# EAGLE schematic RefOsc10MHz_3V0 (EAGLE 7.2.0)
DF4IAH - 10 MHz Reference Oscillator

## Sheet 1 of 15: Overview
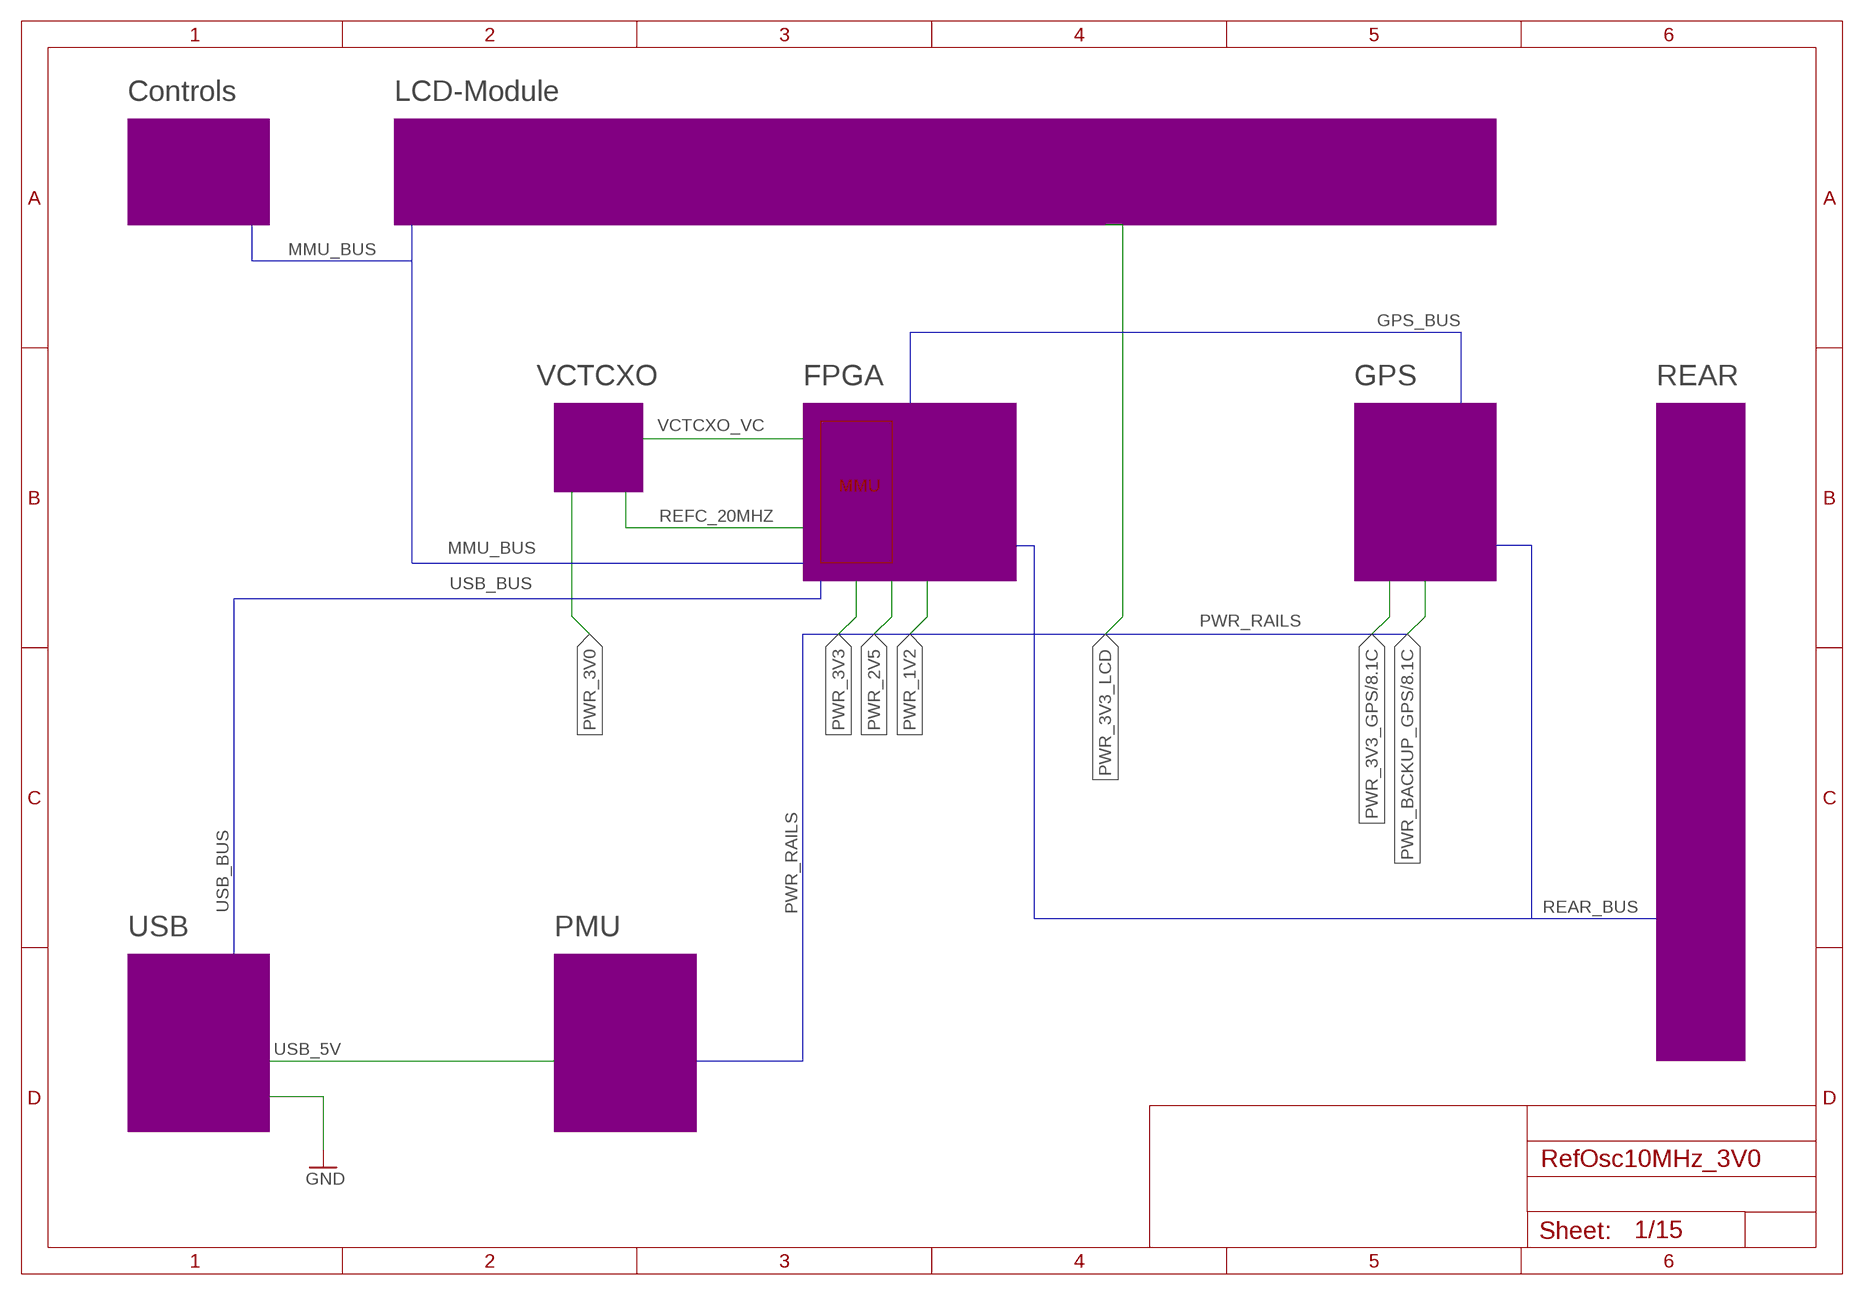
[diagram p0: schematic, sheet 1]

### Buses
USB_BUS
PWR_RAILS
GPS_BUS
REAR_BUS
MMU_BUS

### Notes on the sheet
- Controls | LCD-Module
- VCTCXO | FPGA | GPS | REAR
- MMU
- USB | PMU

## Sheet 2 of 15: FPGA_B1
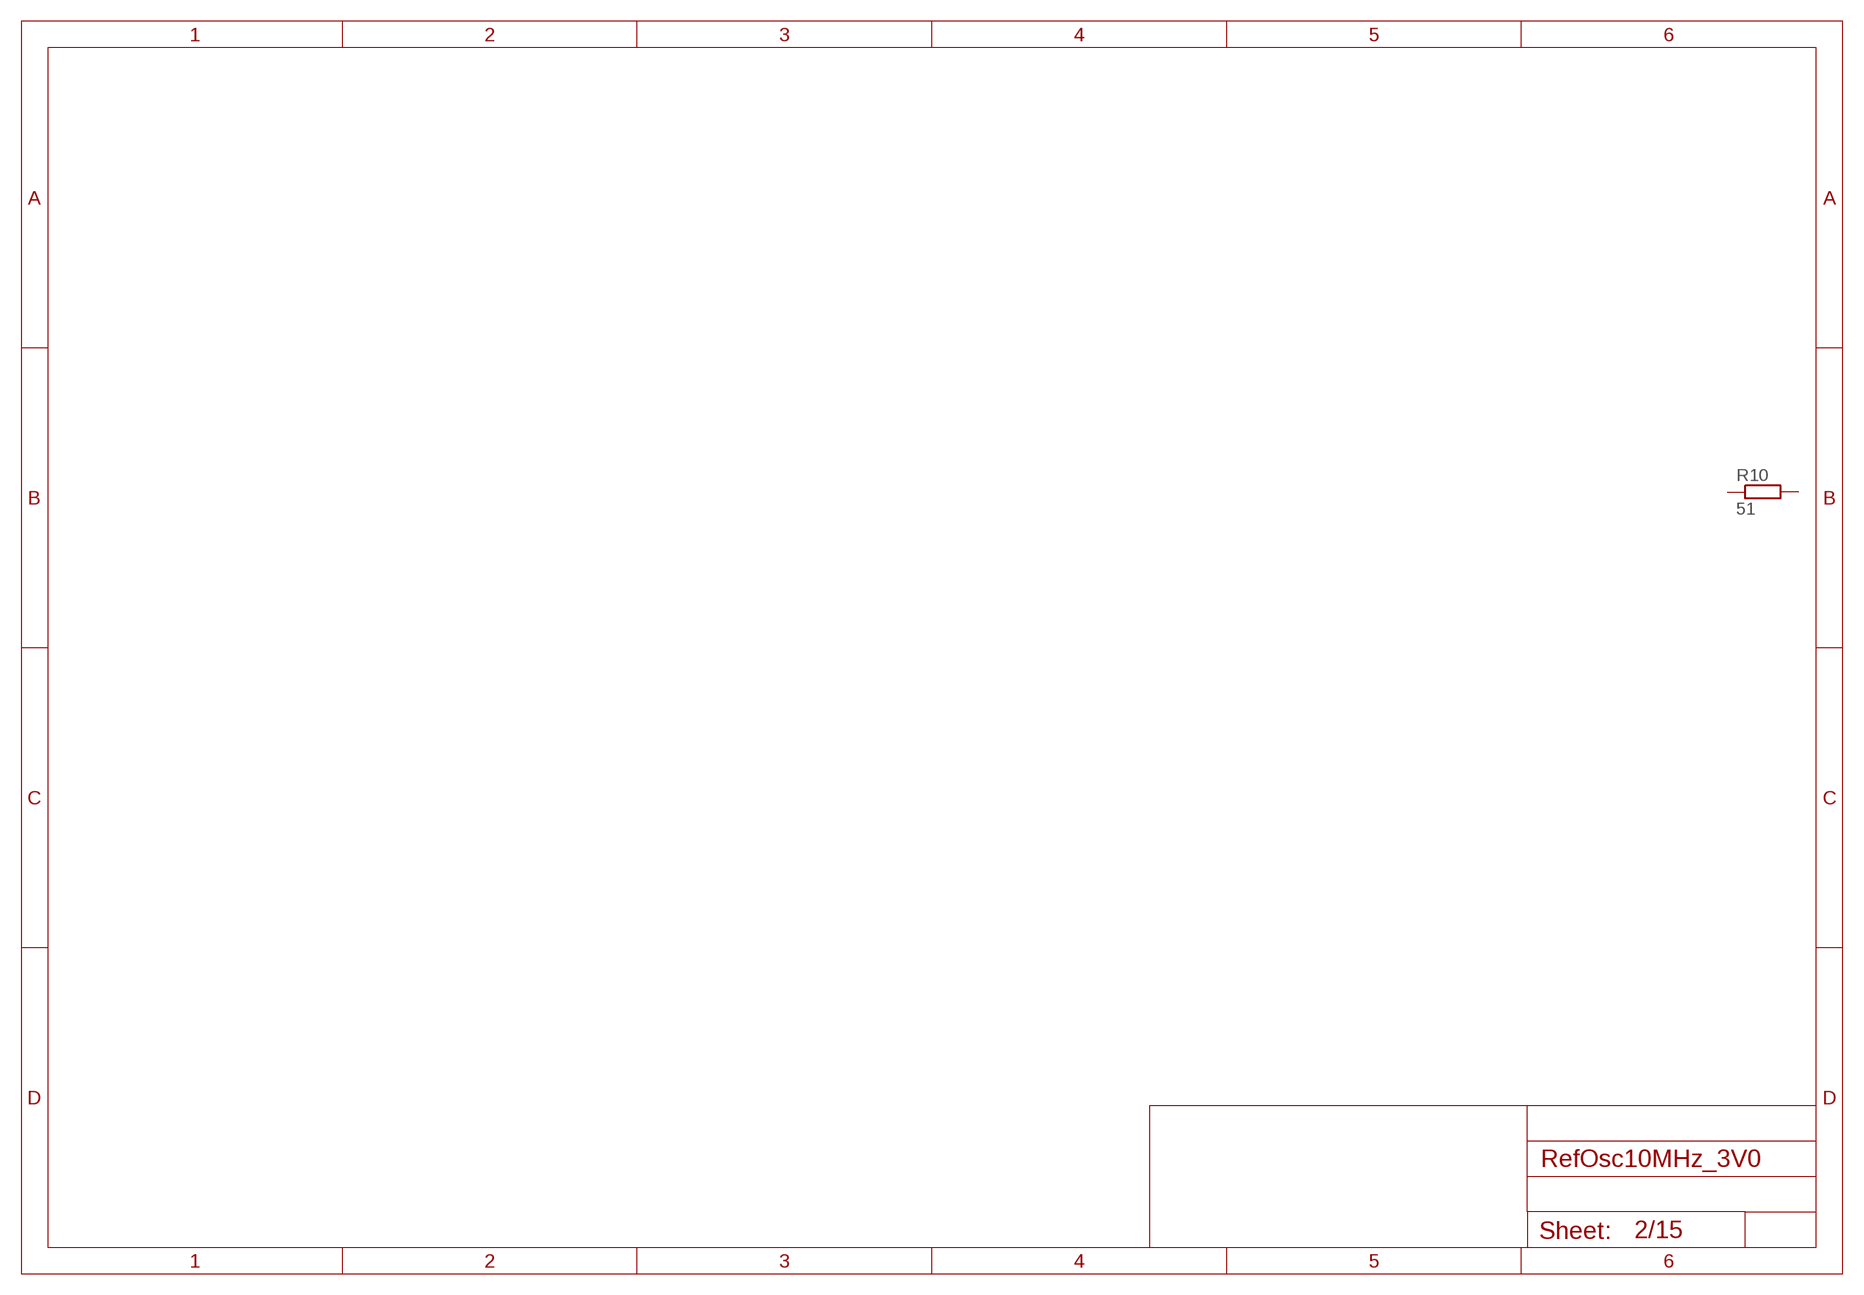
[diagram p1: schematic, sheet 2]

### Parts
R10  51  R-EU_R0805  [R0805]
Unconnected: R10.1 R10.2

## Sheet 3 of 15: FPGA_B2
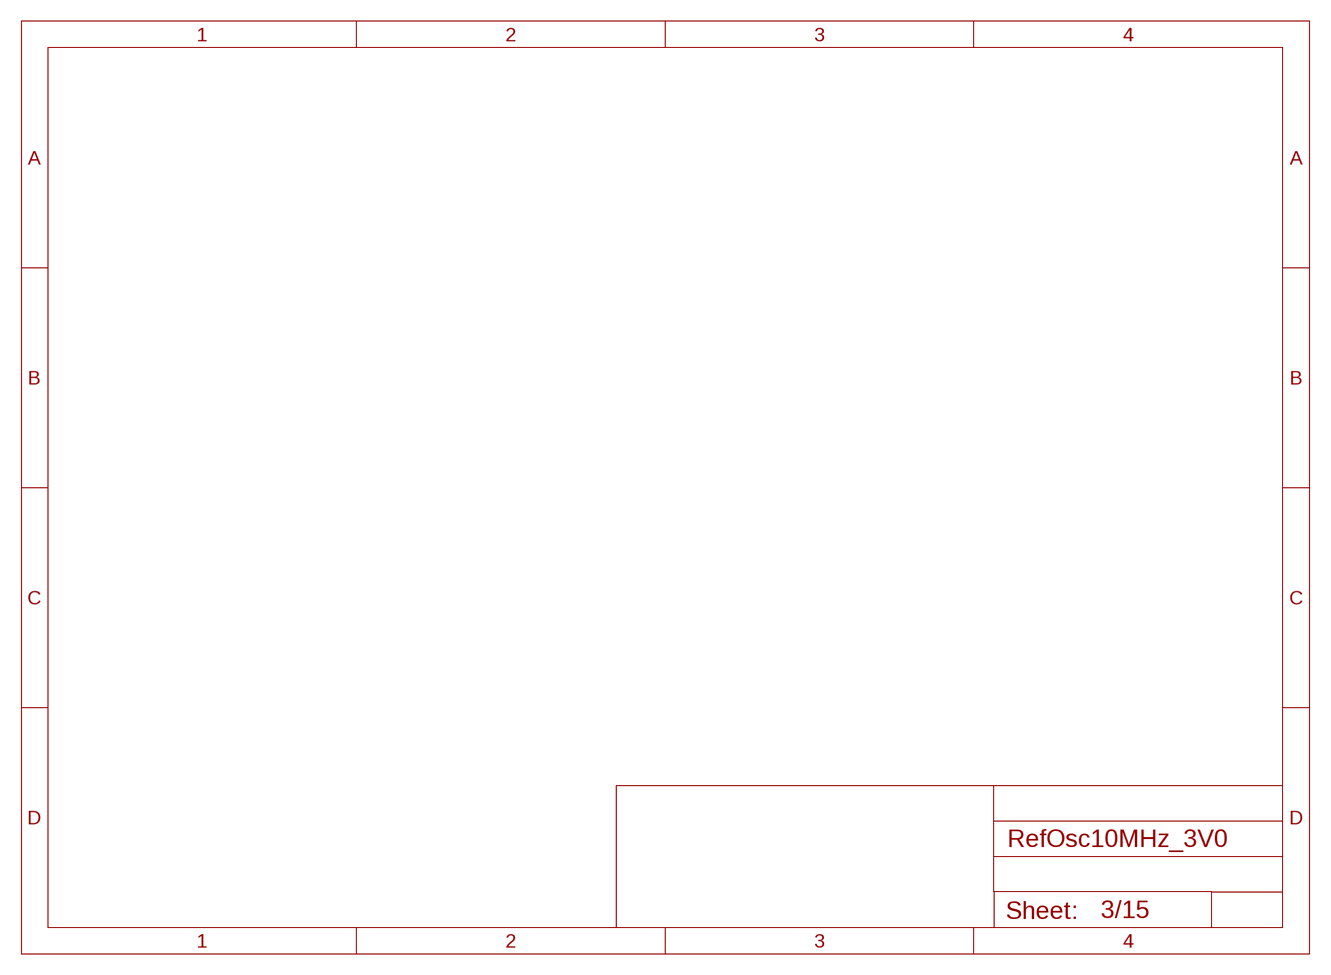
[diagram p2: schematic, sheet 3]

## Sheet 4 of 15: FPGA_B3
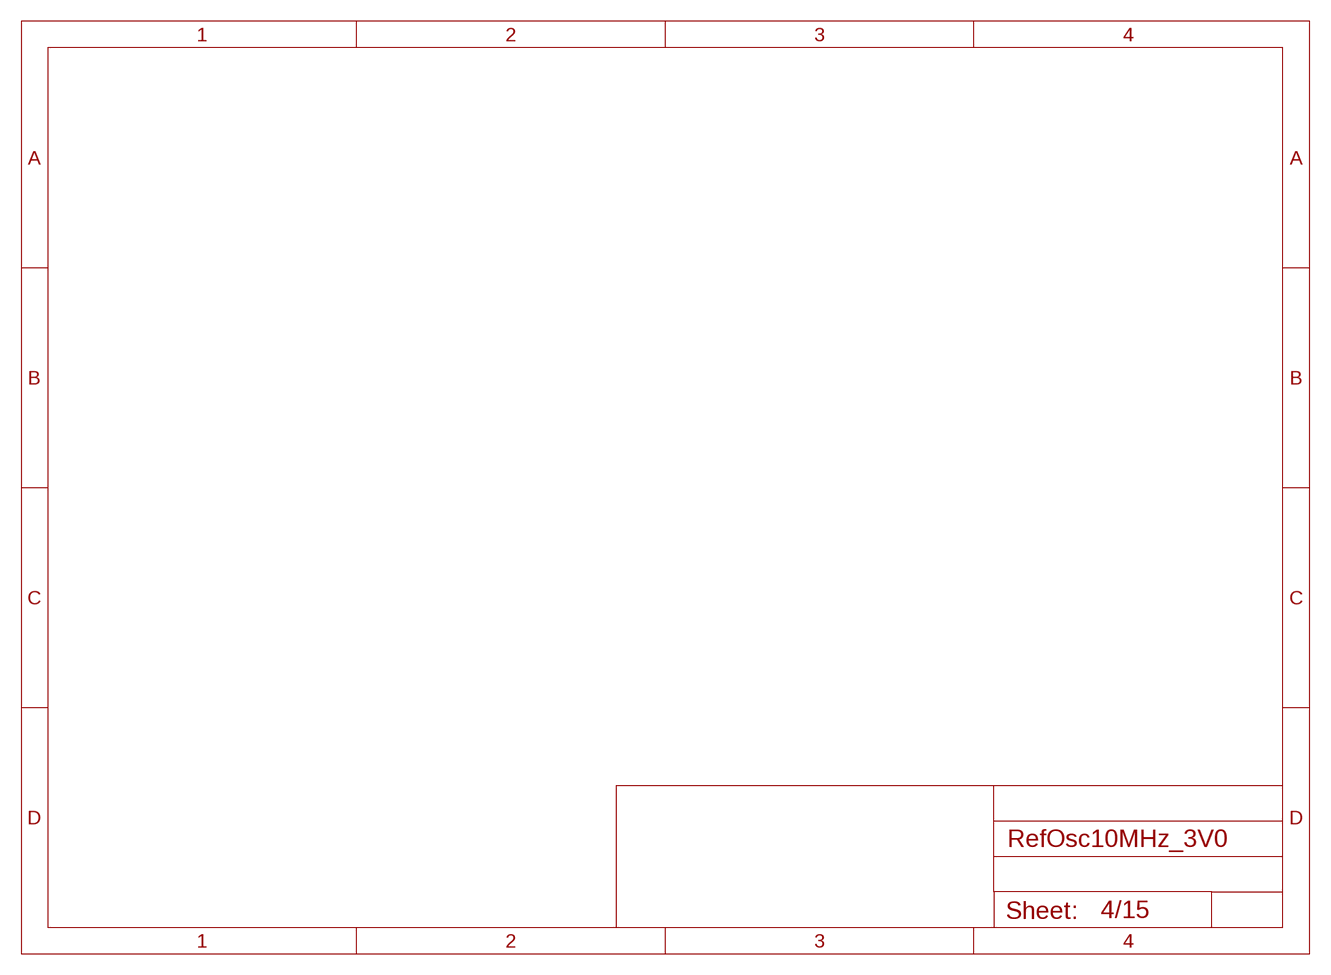
[diagram p3: schematic, sheet 4]

## Sheet 5 of 15: FPGA_B4
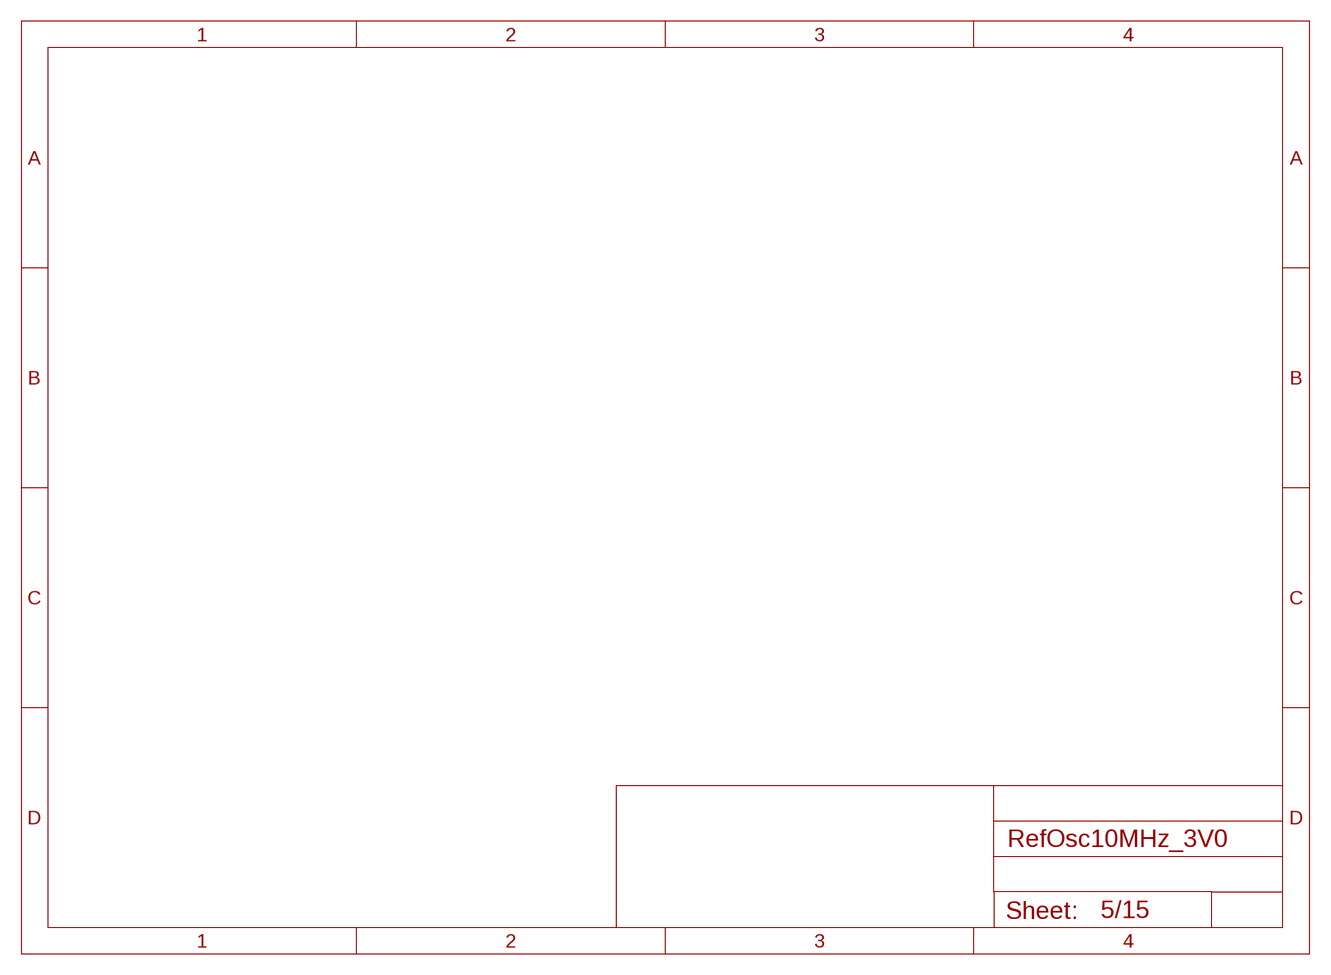
[diagram p4: schematic, sheet 5]

## Sheet 6 of 15: FPGA_JTAG
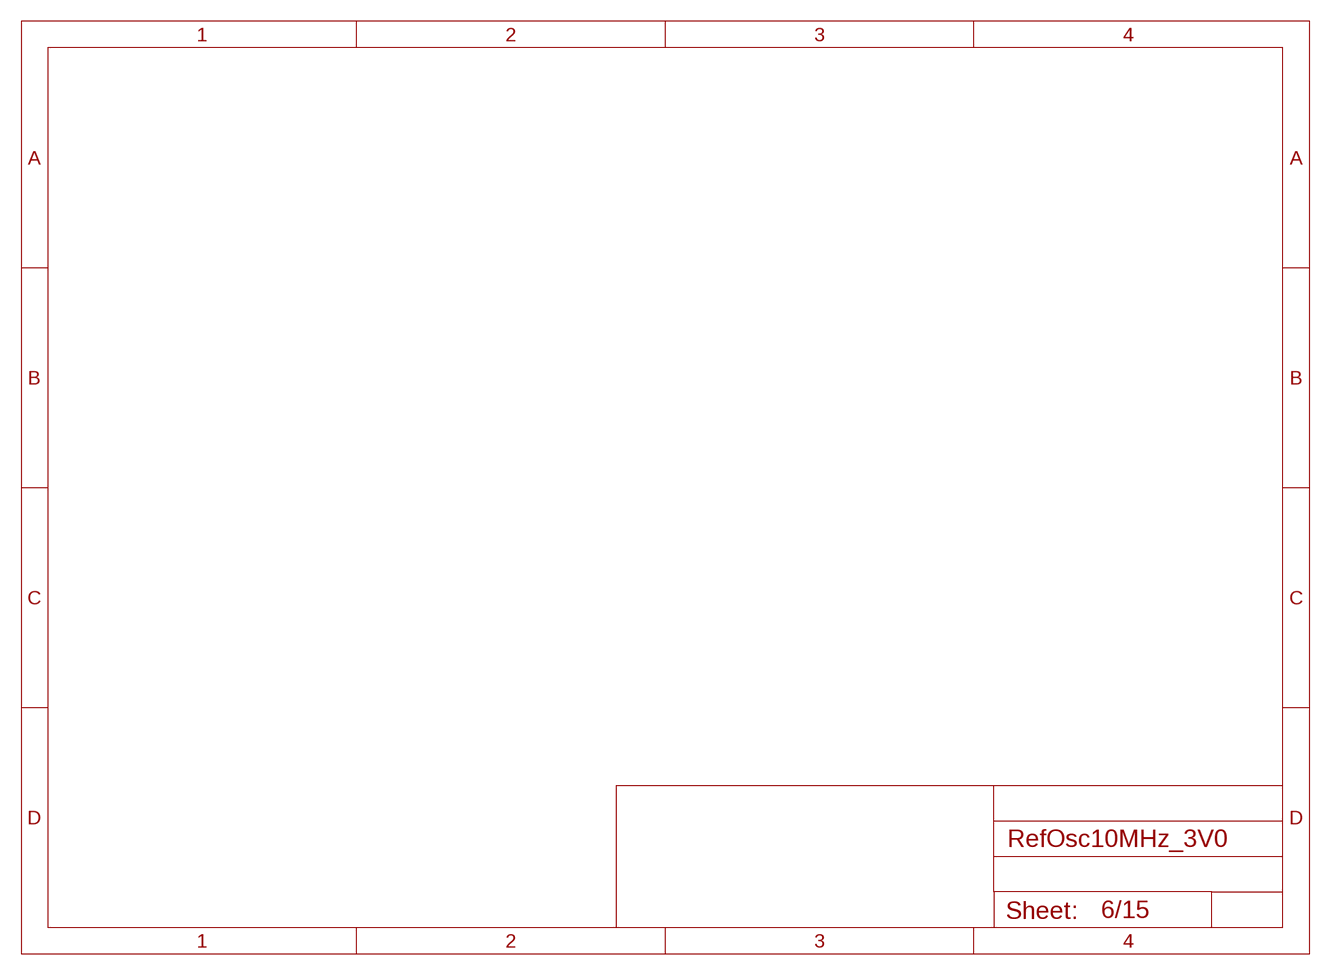
[diagram p5: schematic, sheet 6]

## Sheet 7 of 15: FPGA_PWR
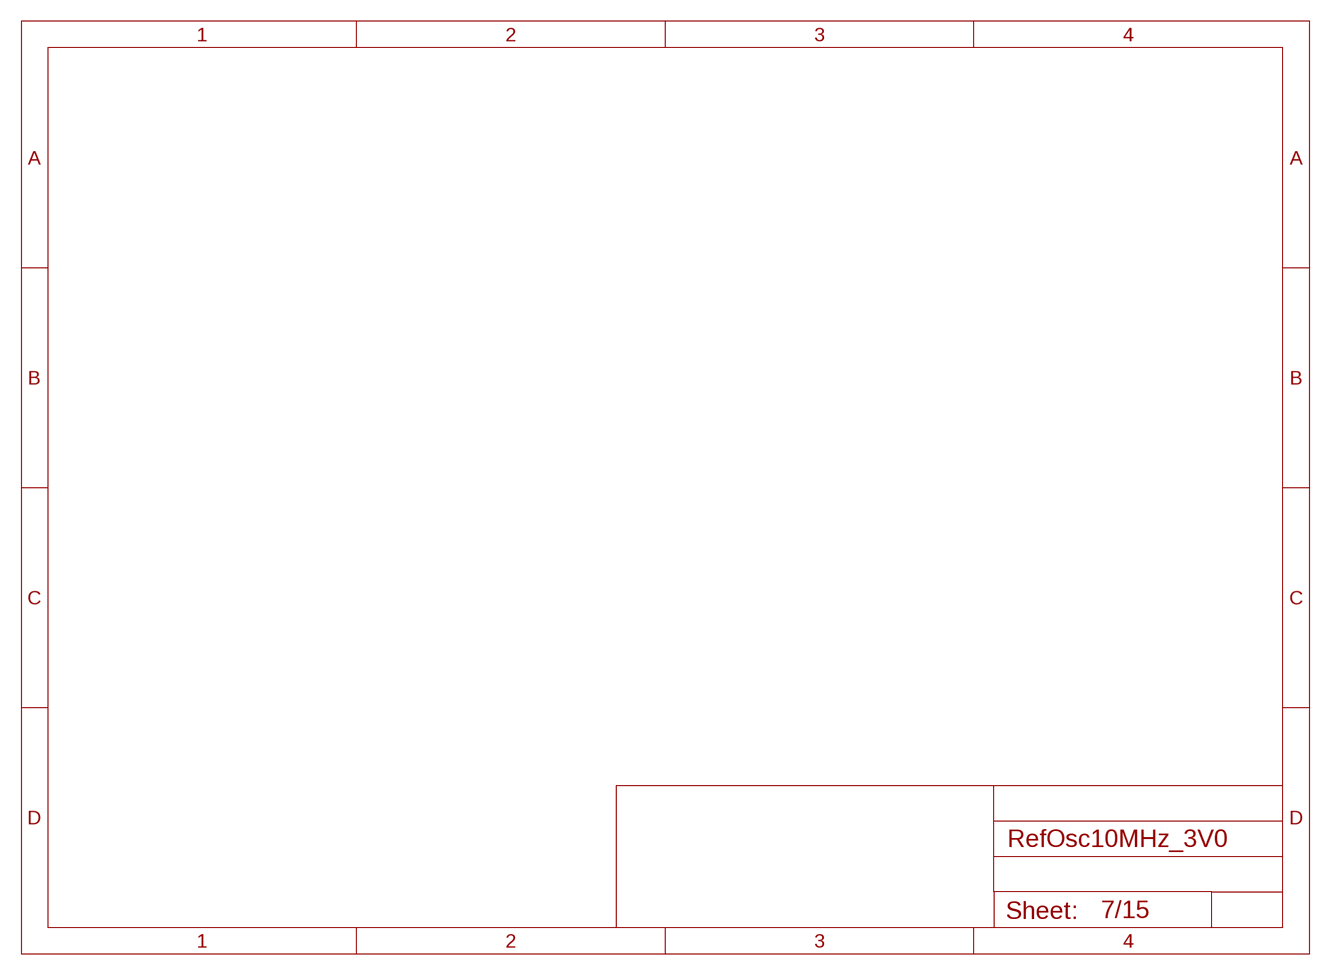
[diagram p6: schematic, sheet 7]

## Sheet 8 of 15: GPS
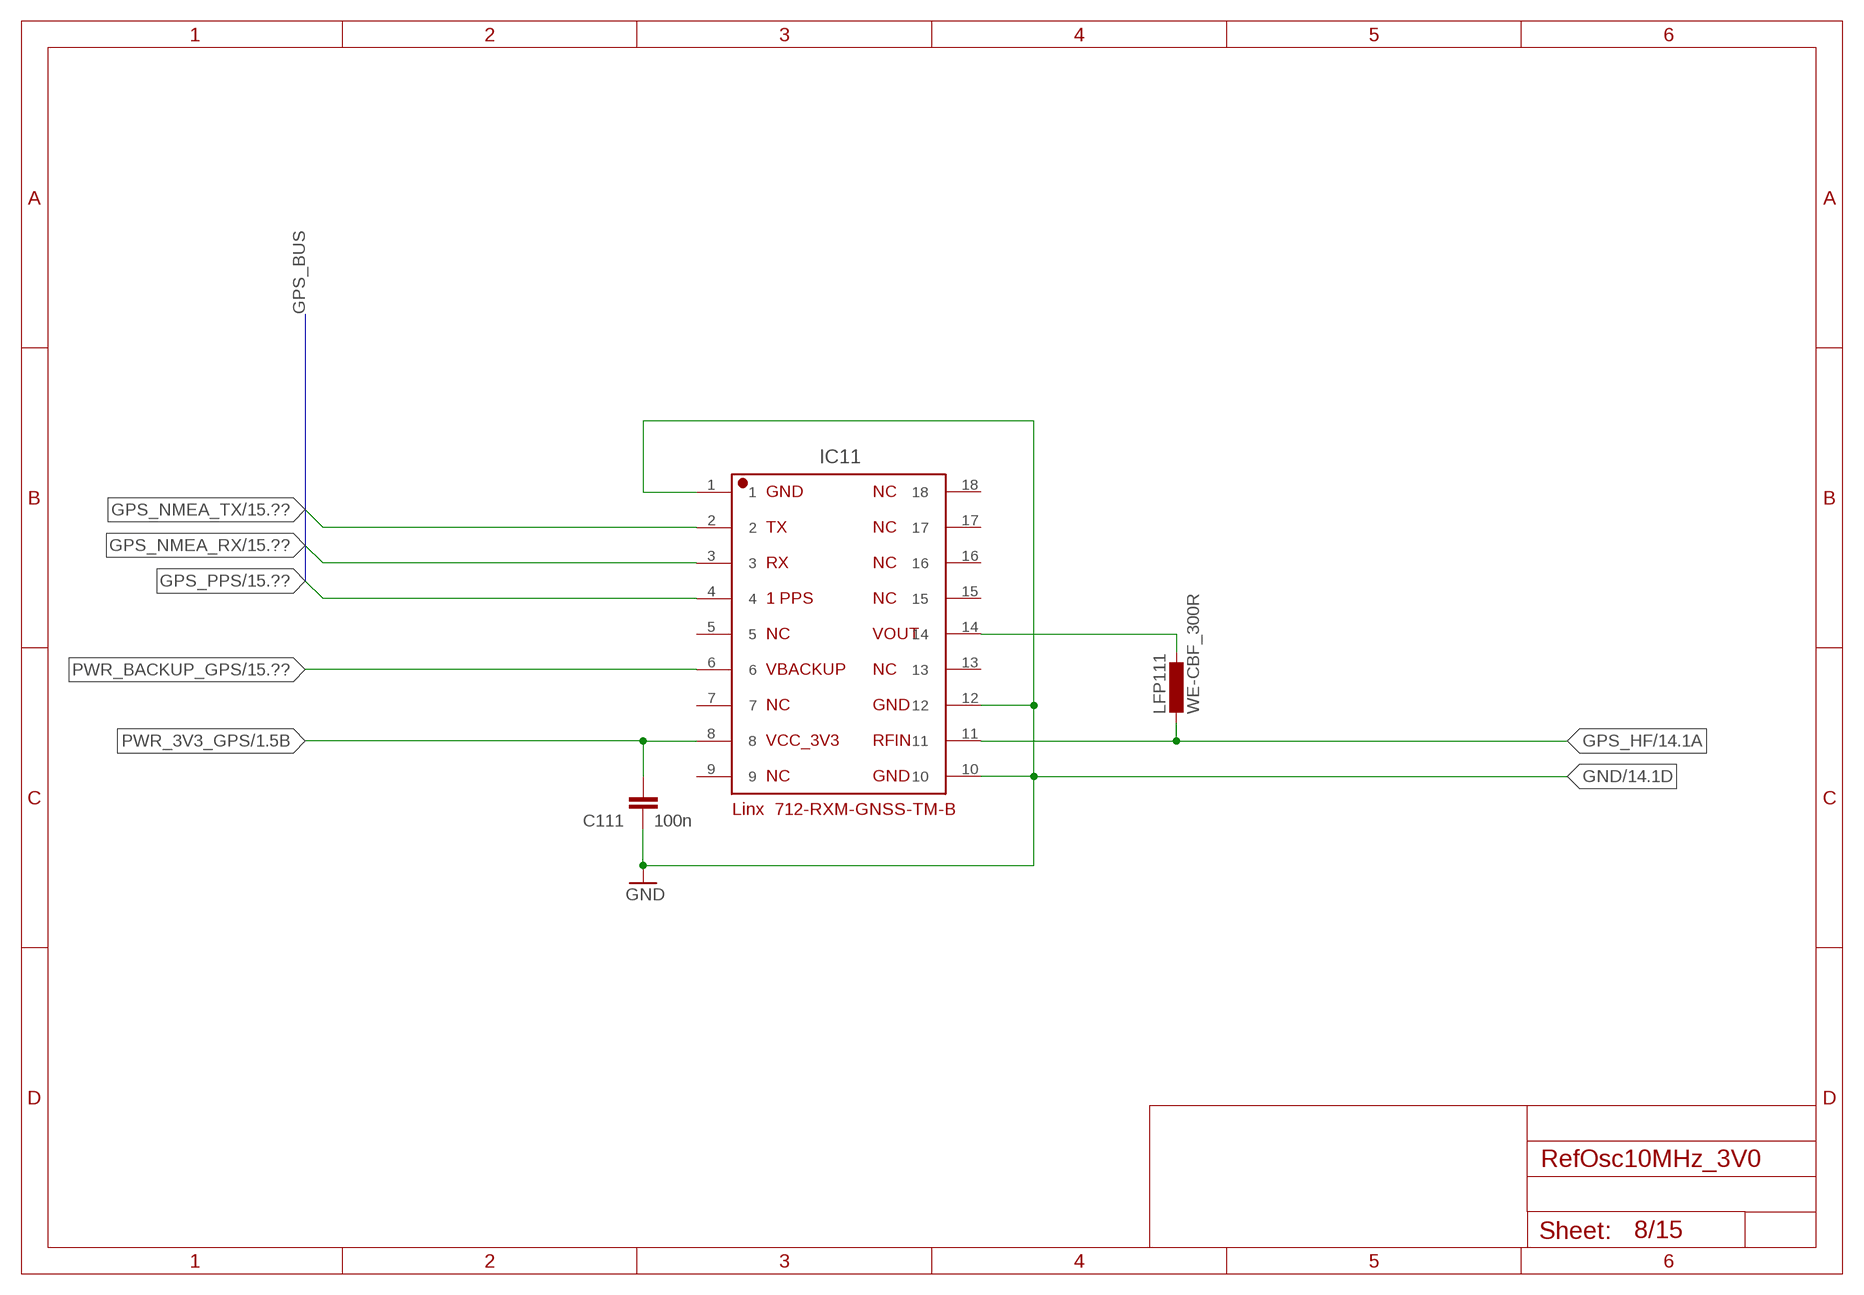
[diagram p7: schematic, sheet 8]

### Parts
C111  100n  C-EUC0805  [C0805]
IC11  712-RXM-GNSS-TM-B  [712-RXM-GNSS-TM-B]
LFP111  WE-CBF_300R  L-EUL3216C  [L3216C]

### Nets
14 [PWR_HI]: IC11.14 LFP111.1
GND [PWR_HI]: C111.2 IC11.1 IC11.10 IC11.12 ; also sheet 1,10,14,15
GPS_HF [PAIR_50R]: IC11.11 LFP111.2 ; also sheet 14
GPS_NMEA_RX: IC11.3 ; also sheet 15
GPS_NMEA_TX: IC11.2 ; also sheet 15
GPS_PPS: IC11.4 ; also sheet 15
PWR_3V3_GPS [PWR_HI]: C111.1 IC11.8 ; also sheet 1
PWR_BACKUP_GPS [PWR_LOW]: IC11.6 ; also sheet 1,15
Unconnected: IC11.5 IC11.7 IC11.9 IC11.13 IC11.15 IC11.16 IC11.17 IC11.18

### Buses
GPS_BUS

## Sheet 9 of 15: VCTCXO
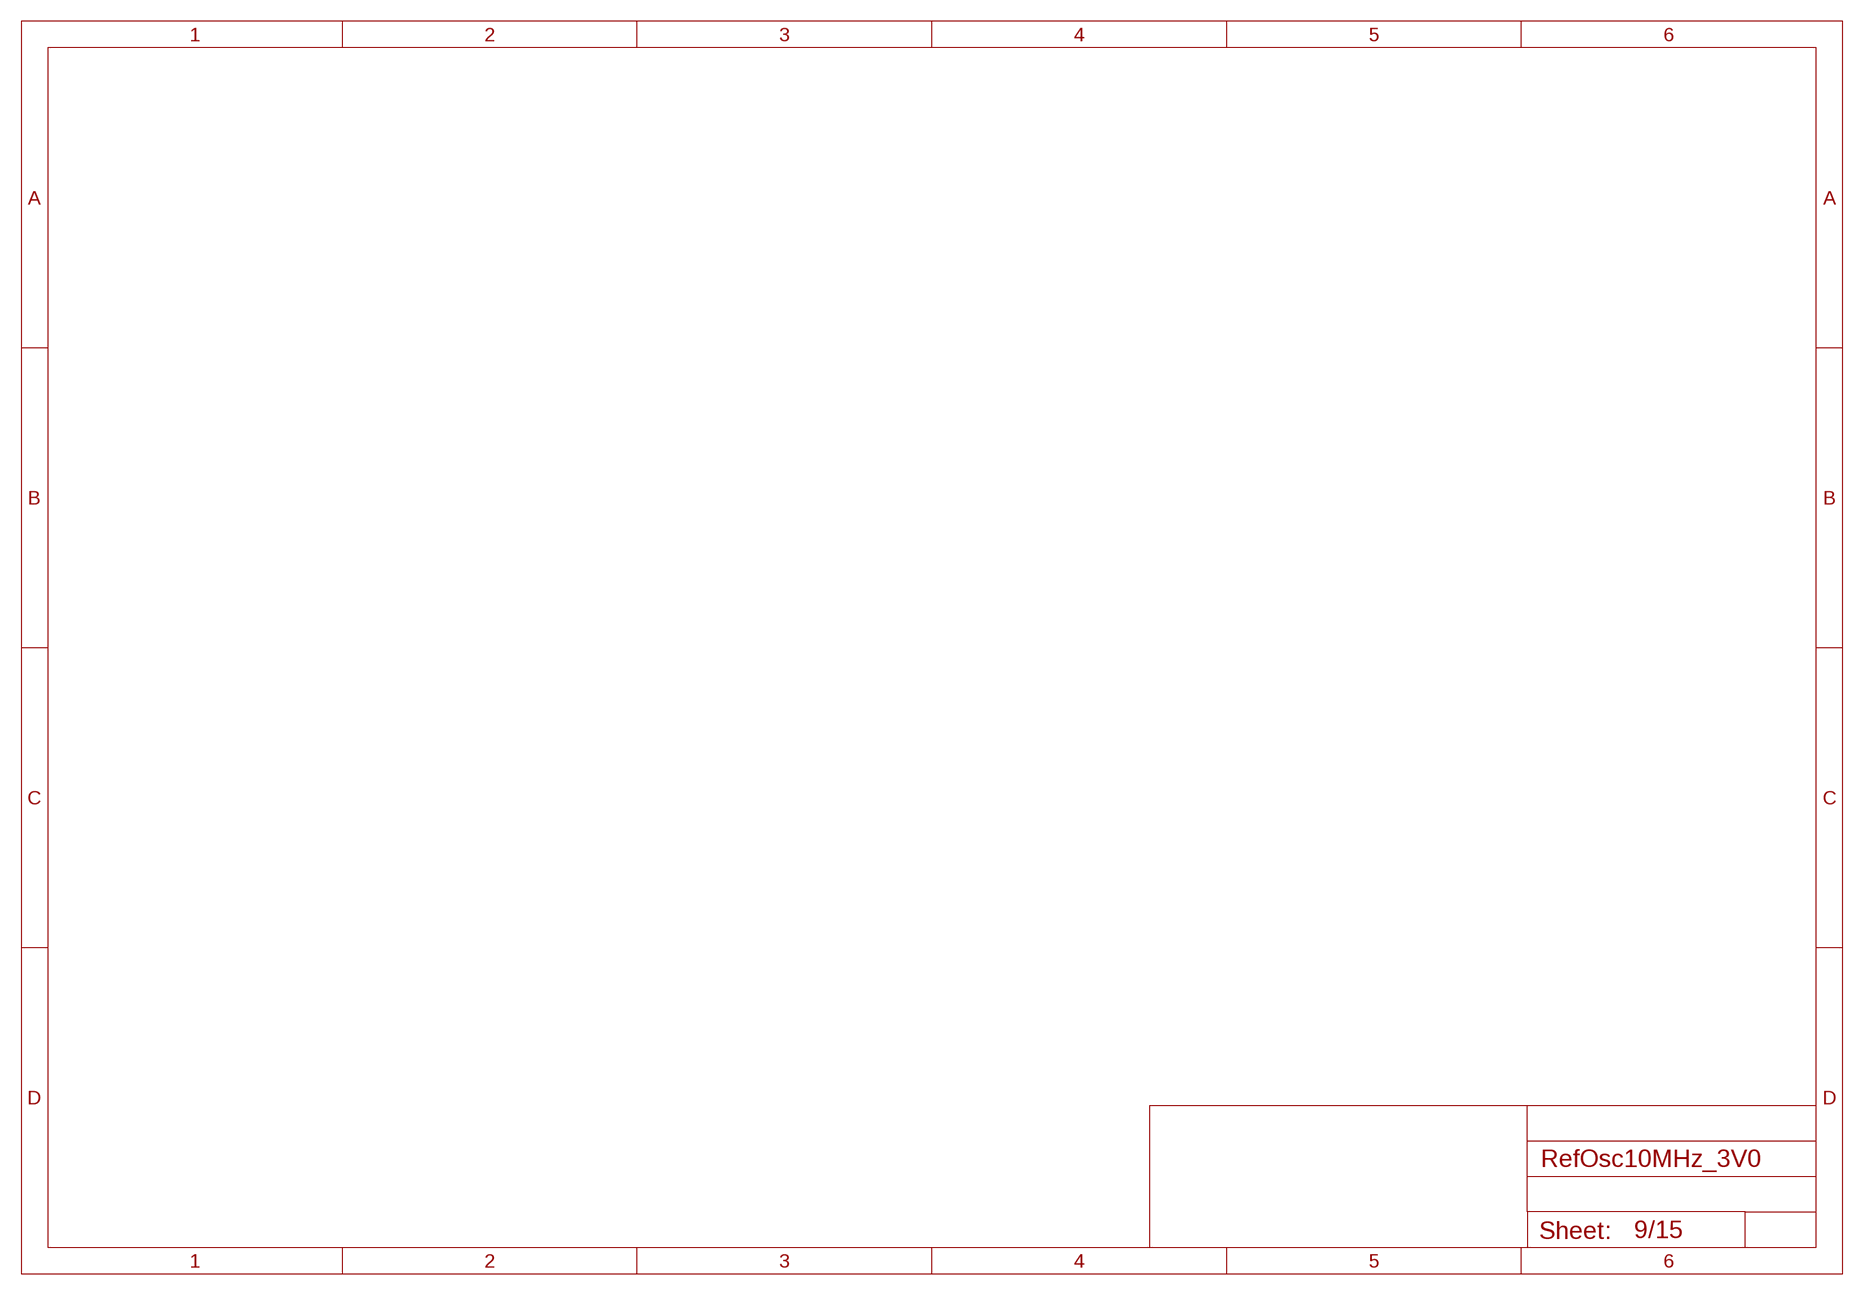
[diagram p8: schematic, sheet 9]

## Sheet 10 of 15: USB
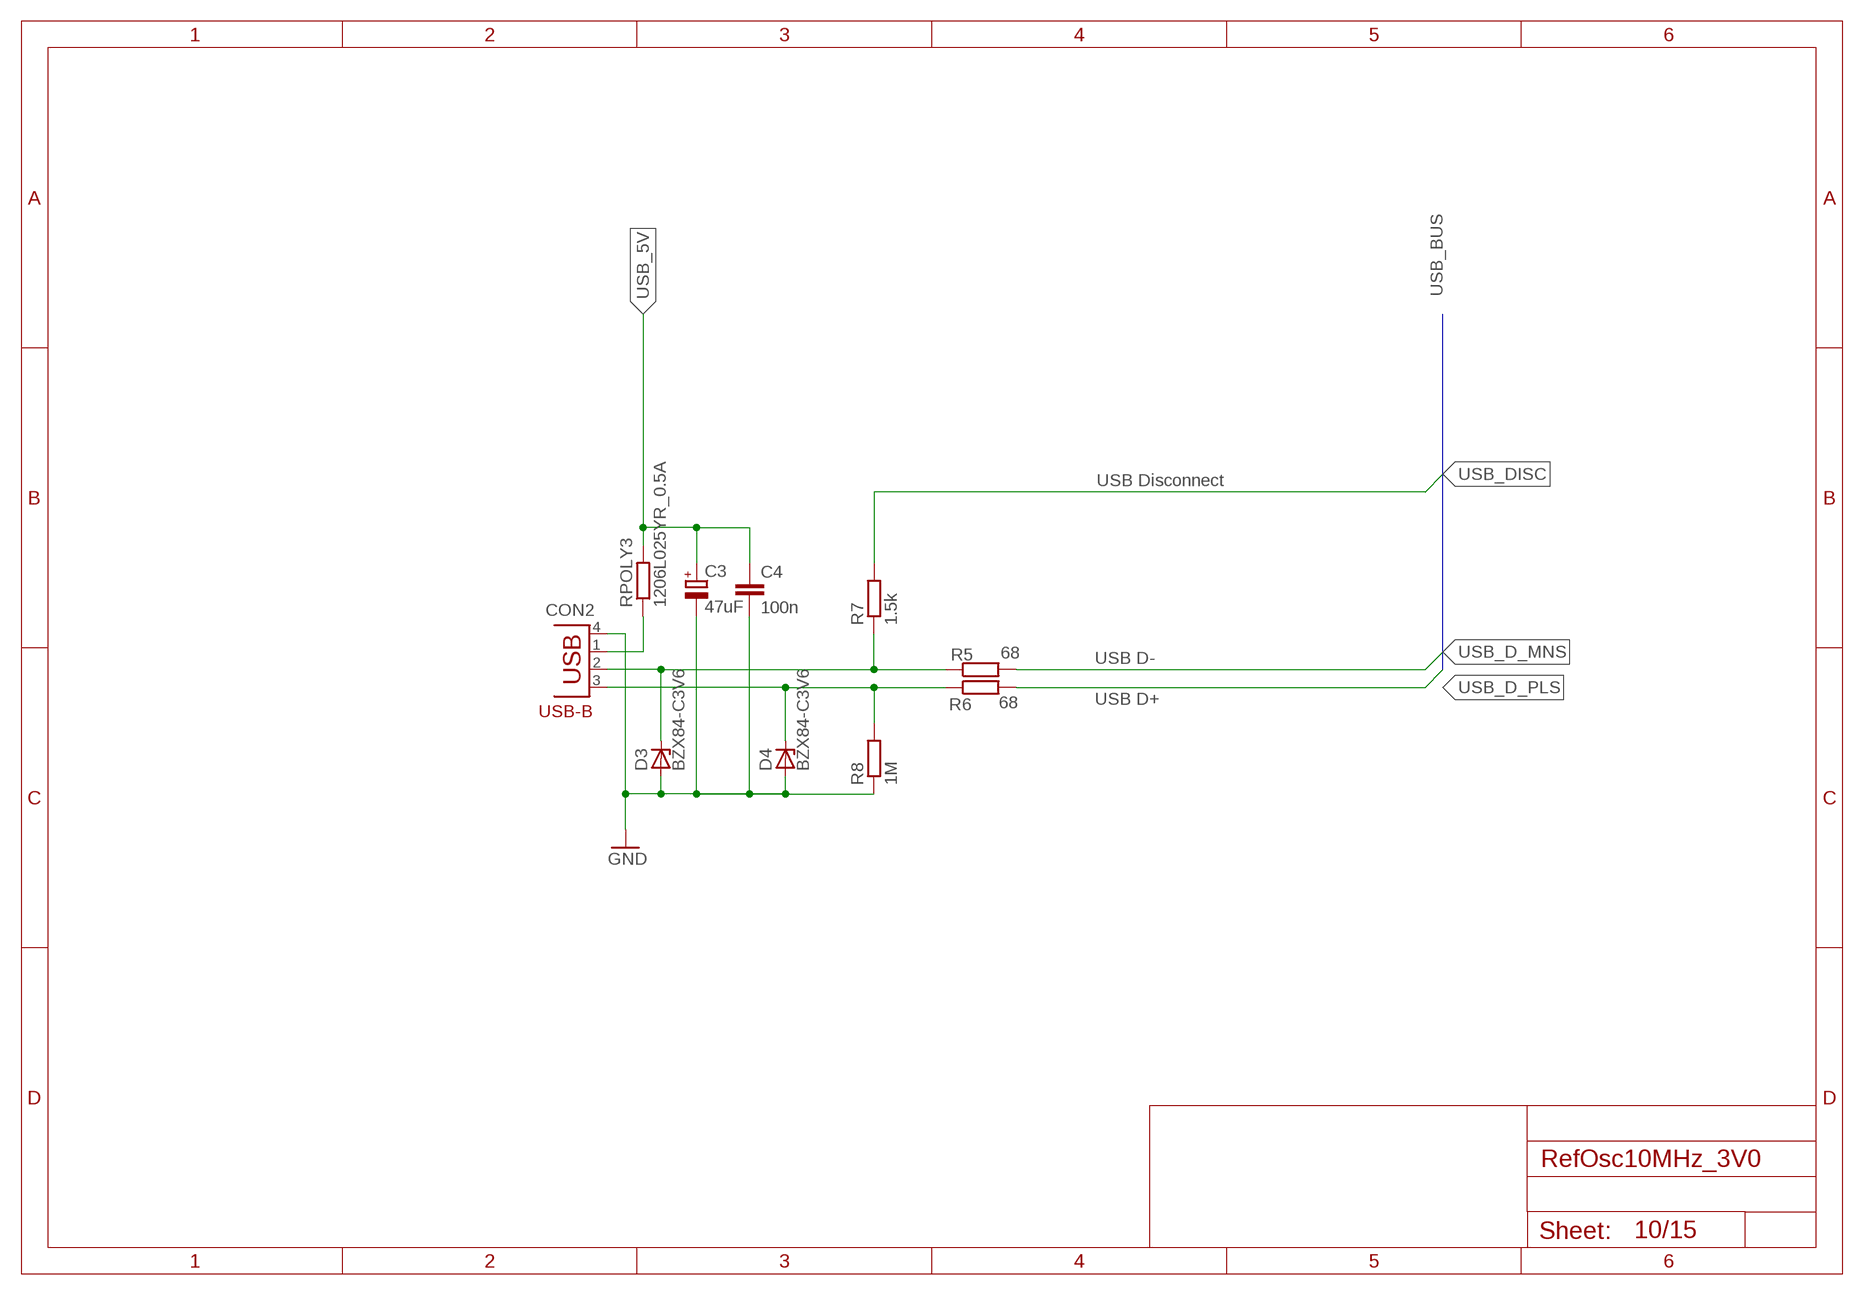
[diagram p9: schematic, sheet 10]

### Parts
C3  47uF  CPOL-EUC  [PANASONIC_C]
C4  100n  C-EUC0805  [C0805]
CON2  TYCO-AMP_USBUSB-B_SMT  [TYCO-AMP_USB-B_SMT]
D3  BZX84-C3V6  BZX84CSMD  [TO236]
D4  BZX84-C3V6  BZX84CSMD  [TO236]
R5  68  R-EU_R0805  [R0805]
R6  68  R-EU_R0805  [R0805]
R7  1.5k  R-EU_R0805  [R0805]
R8  1M  R-EU_R0805  [R0805]
RPOLY3  1206L025YR_0.5A  R-EU_M1206  [M1206]

### Nets
GND [PWR_HI]: C3.- C4.2 CON2.4(GND) D3.A D4.A R8.1 ; also sheet 1,8,14,15
USB_5V [PWR_HI]: C3.+ C4.1 RPOLY3.2 ; also sheet 1
USB_D_MIN1: CON2.2(D-) D3.C R5.1 R7.1
USB_D_MNS: R5.2
USB_D_PLS: R6.2
USB_D_PLS1: CON2.3(D+) D4.C R6.1 R8.2
USB_DISC: R7.2
USB_PWR1: CON2.1(VBUS) RPOLY3.1

### Buses
USB_BUS

### Notes on the sheet
- USB Disconnect
- USB D-
- USB D+
- USB-B

## Sheet 11 of 15: PMU
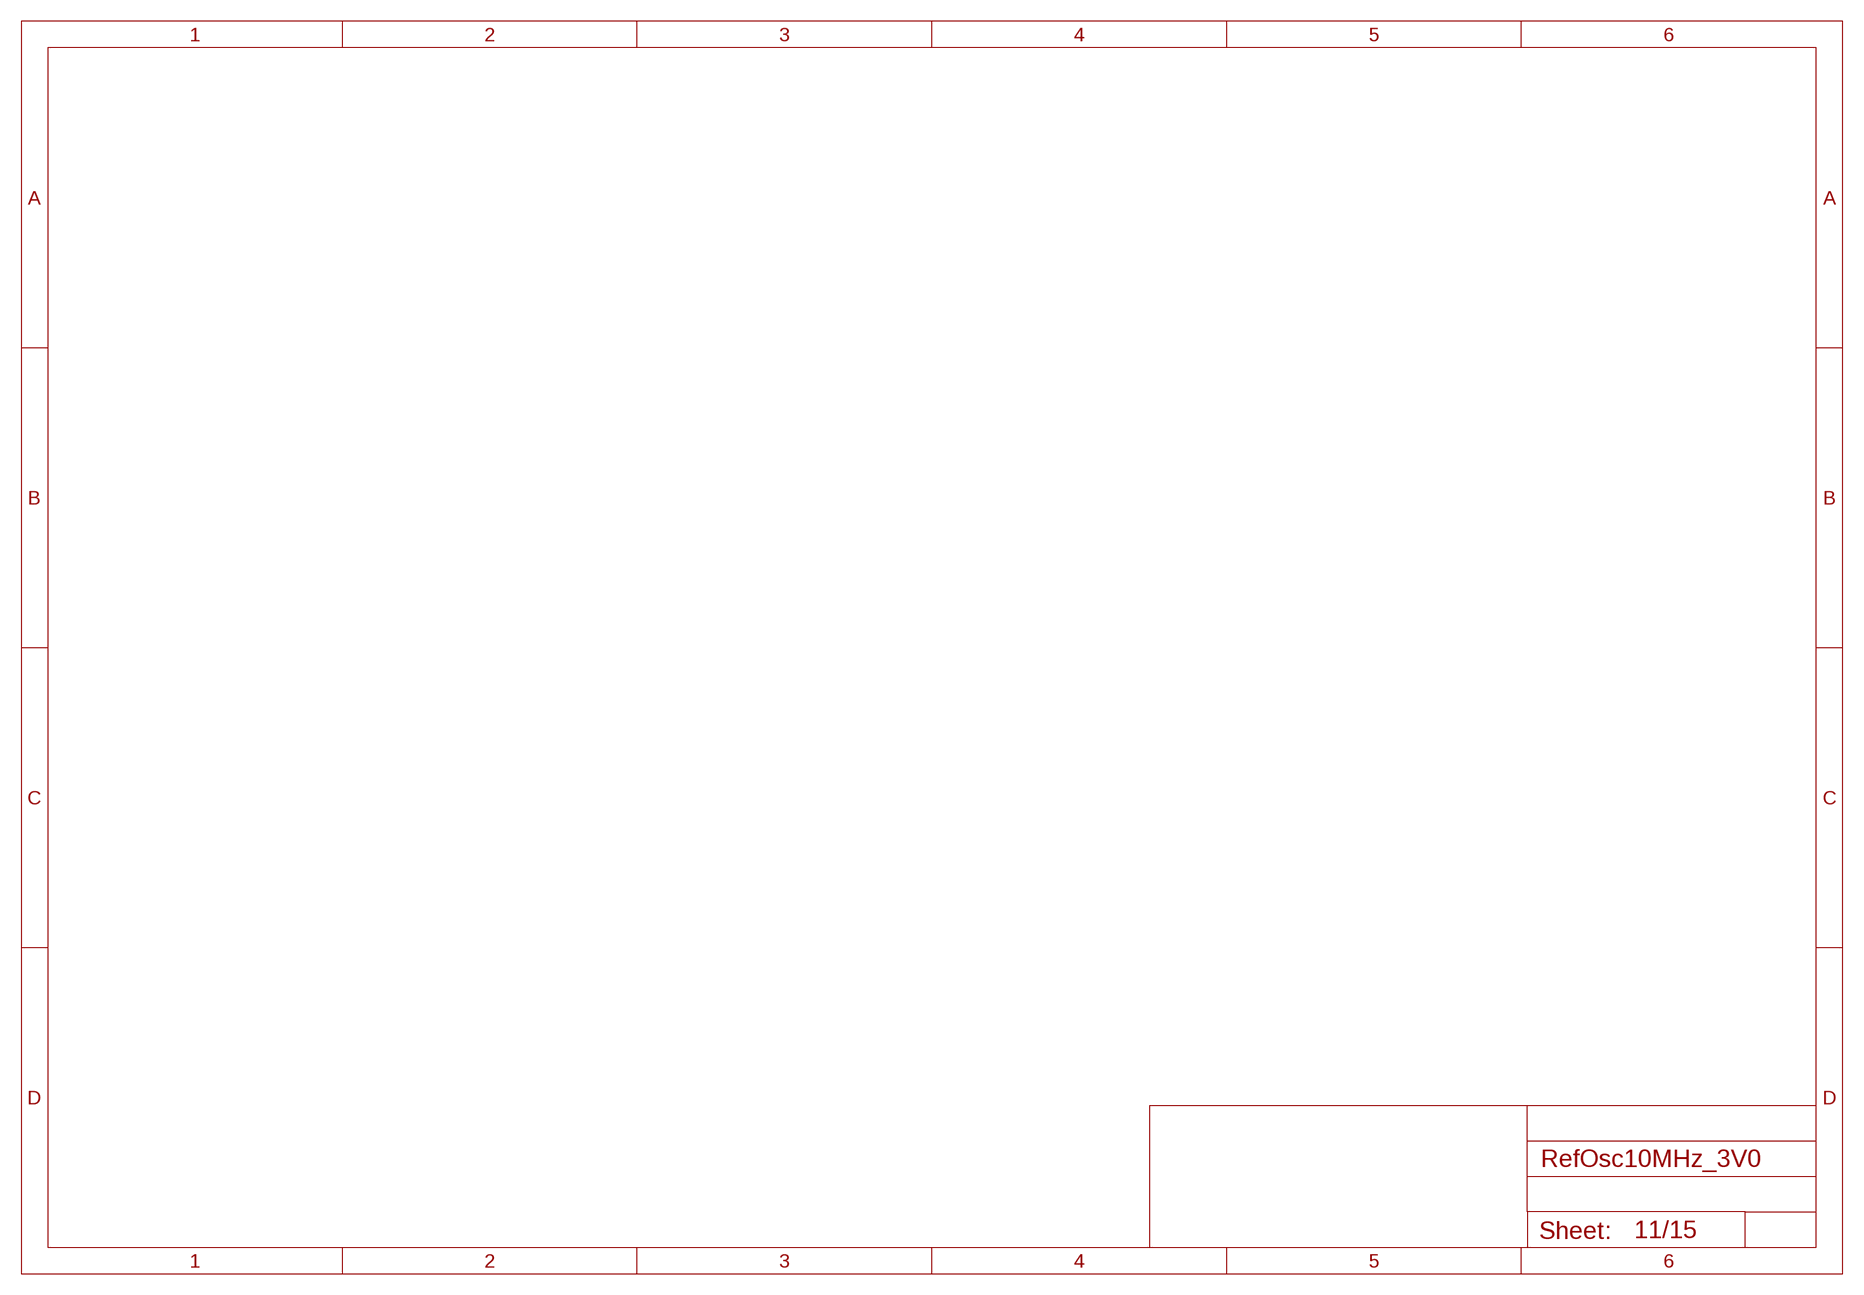
[diagram p10: schematic, sheet 11]

## Sheet 12 of 15: LCD-Module
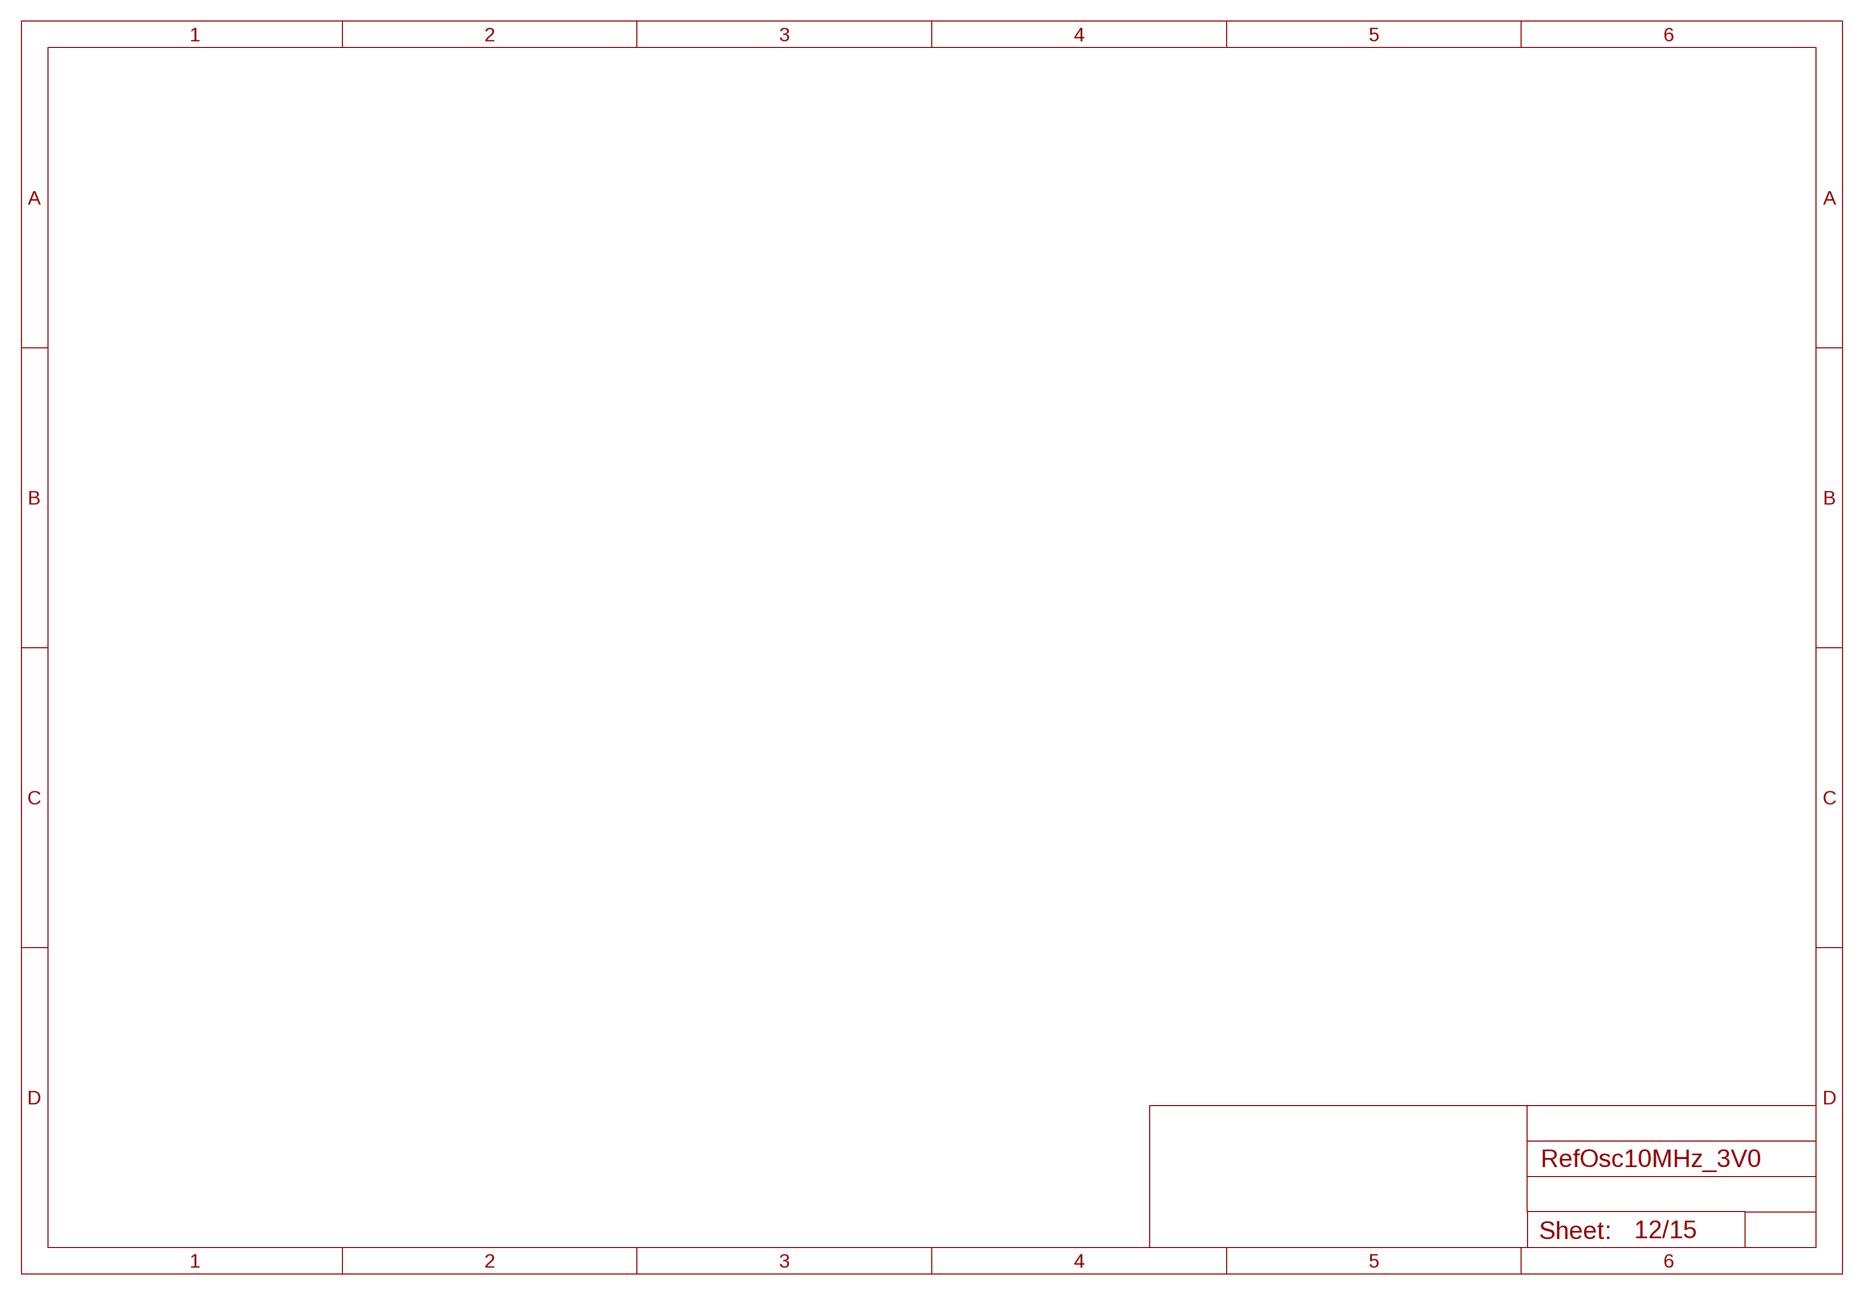
[diagram p11: schematic, sheet 12]

## Sheet 13 of 15: Controls
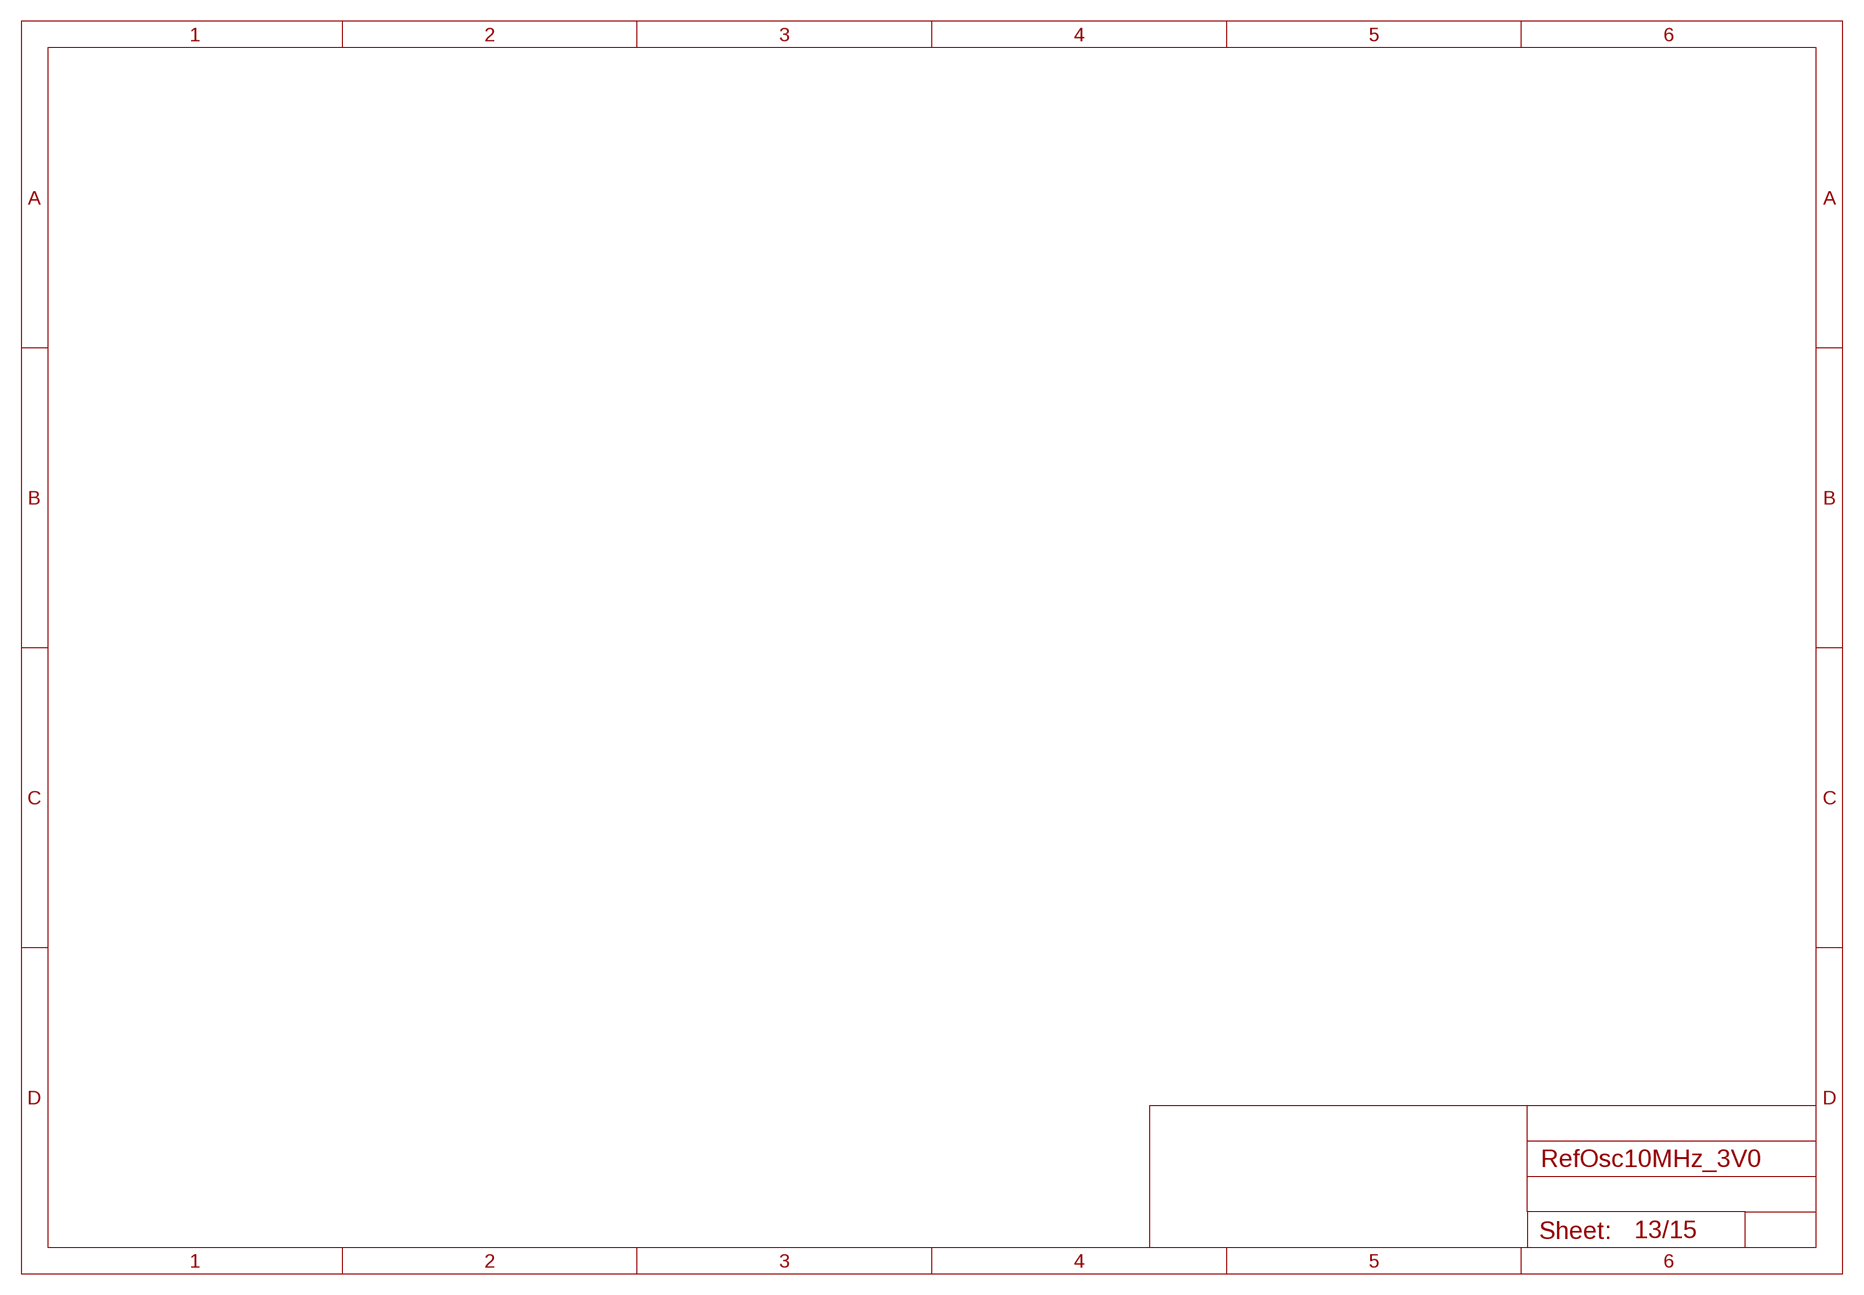
[diagram p12: schematic, sheet 13]

## Sheet 14 of 15: REAR
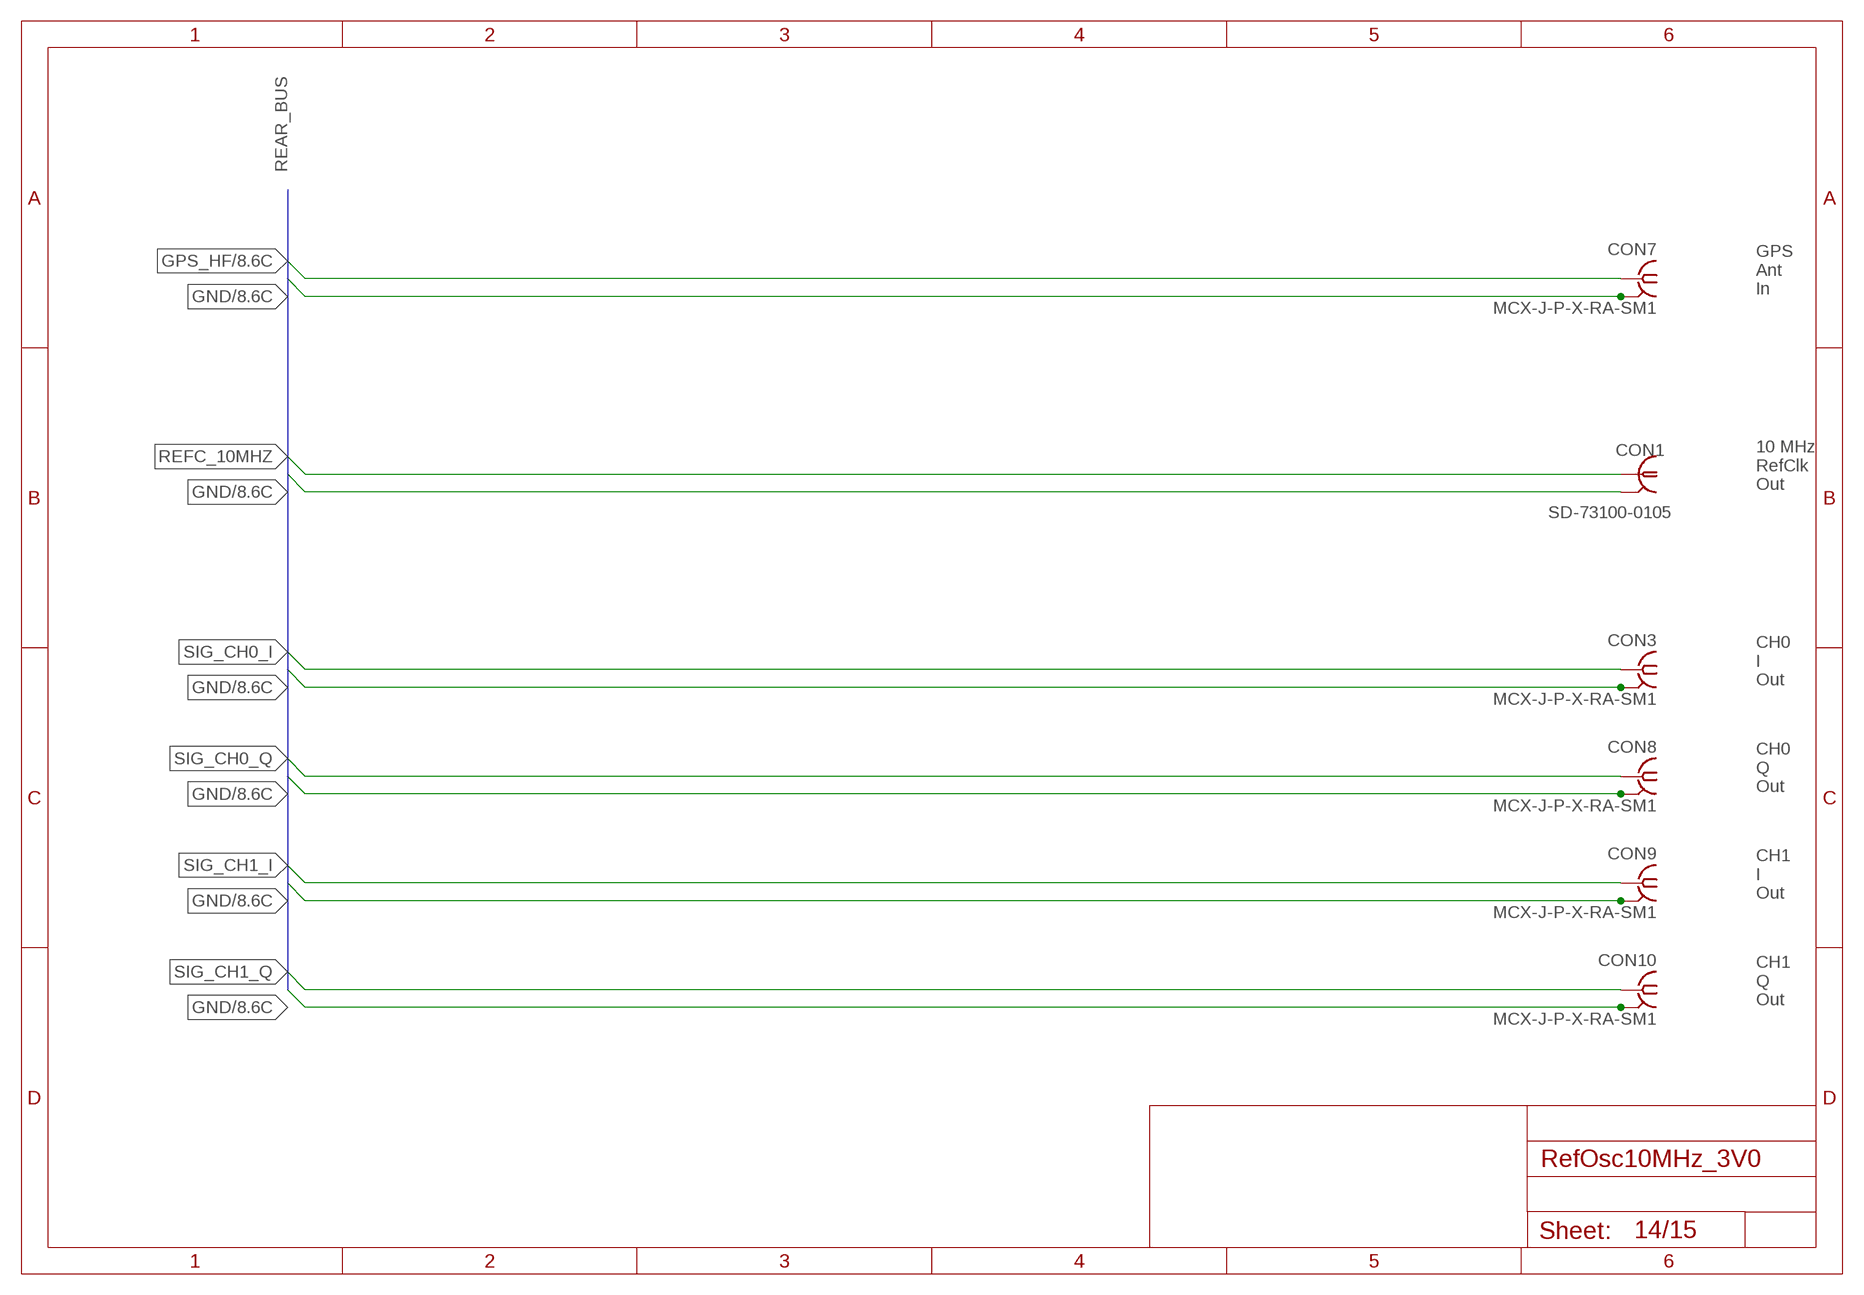
[diagram p13: schematic, sheet 14]

### Parts
CON1  SD-73100-0105  MOLEX_BNC-JACK-50R_SD-73100-0105  [MOLEX_BNC-JACK-50R_SD-73100-0105]
CON3  MCX-J-P-X-RA-SM1  [MCX-J-P-X-RA-SM1]
CON7  MCX-J-P-X-RA-SM1  [MCX-J-P-X-RA-SM1]
CON8  MCX-J-P-X-RA-SM1  [MCX-J-P-X-RA-SM1]
CON9  MCX-J-P-X-RA-SM1  [MCX-J-P-X-RA-SM1]
CON10  MCX-J-P-X-RA-SM1  [MCX-J-P-X-RA-SM1]

### Nets
GND [PWR_HI]: CON1.2 CON1.3 CON3.2 CON3.3 CON3.4 CON3.5 CON7.2 CON7.3 CON7.4 CON7.5 CON8.2 CON8.3 CON8.4 CON8.5 CON9.2 CON9.3 CON9.4 CON9.5 CON10.2 CON10.3 CON10.4 CON10.5 ; also sheet 1,8,10,15
GPS_HF [PAIR_50R]: CON7.1 ; also sheet 8
REFC_10MHZ: CON1.1
SIG_CH0_I: CON3.1
SIG_CH0_Q: CON8.1
SIG_CH1_I: CON9.1
SIG_CH1_Q: CON10.1

### Buses
REAR_BUS

### Notes on the sheet
- GPS
  Ant
  In
- 10 MHz
  RefClk
  Out
- CH0
  I
  Out
- CH0
  Q
  Out
- CH1
  I
  Out
- CH1
  Q
  Out

## Sheet 15 of 15: Main
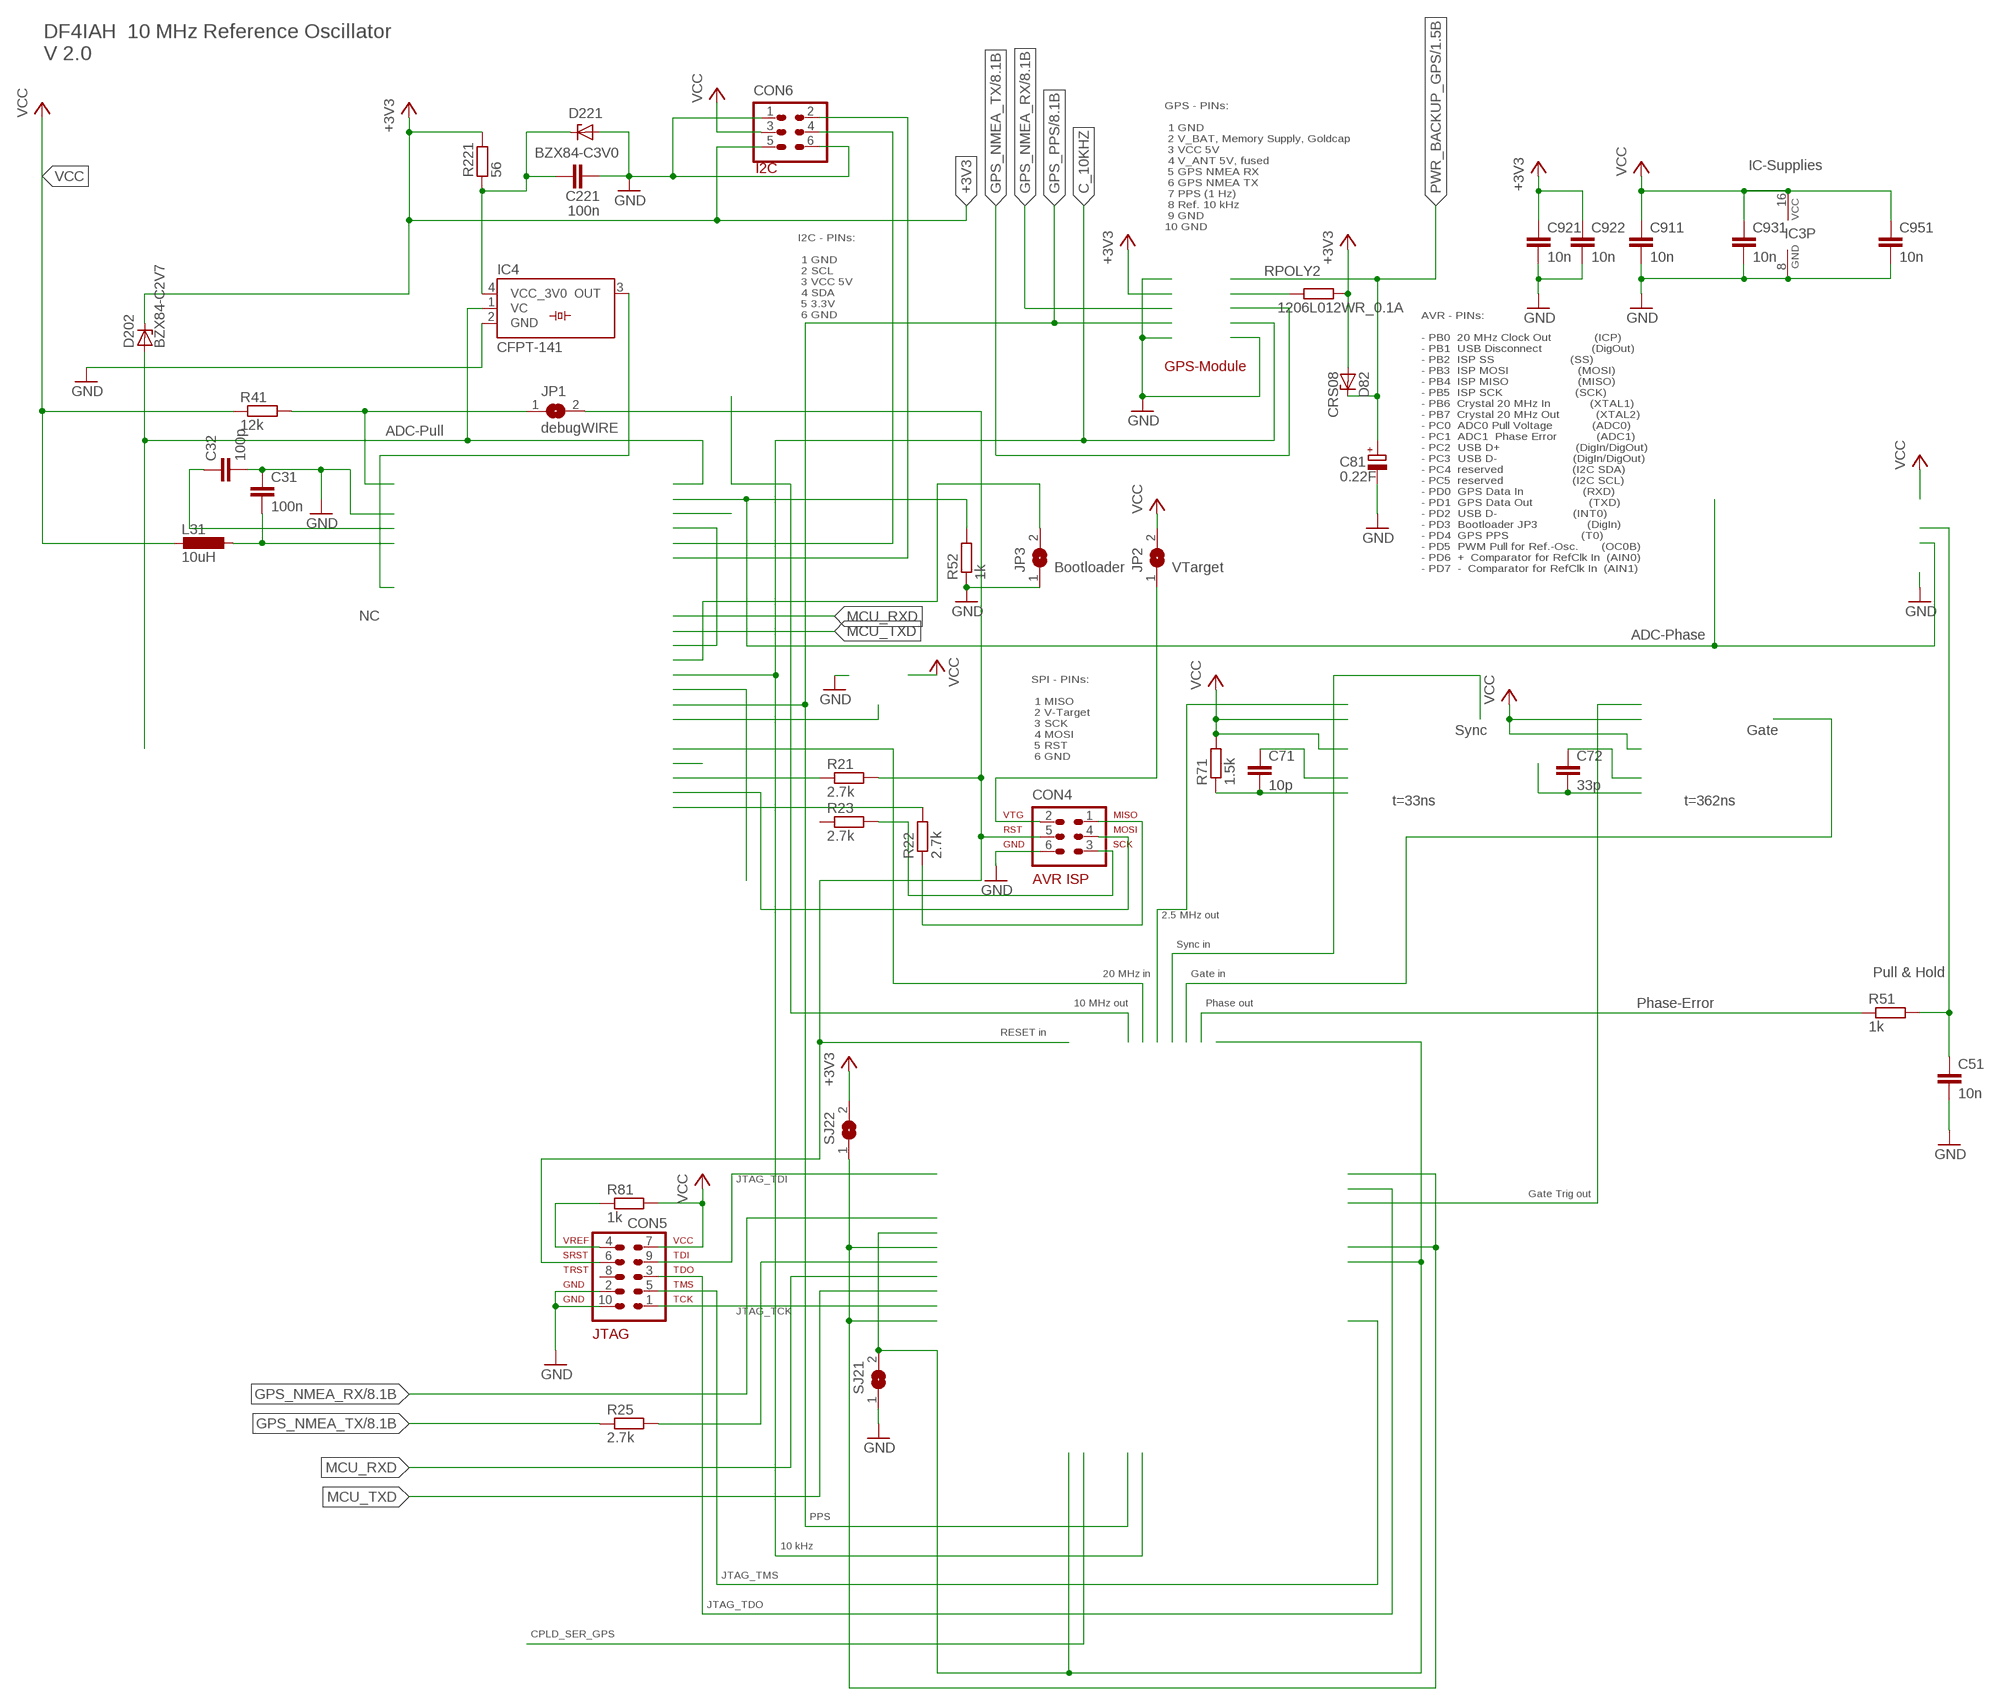
[diagram p14: schematic, sheet 15]

### Parts
C31  100n  C-EUC0805  [C0805]
C32  100p  C-EUC0805  [C0805]
C51  10n  C-EUC0805  [C0805]
C71  10p  C-EUC0805  [C0805]
C72  33p  C-EUC0805  [C0805]
C81  0.22F  CPOL-EUC  [PANASONIC_C]
C221  100n  C-EUC0805  [C0805]
C911  10n  C-EUC0805  [C0805]
C921  10n  C-EUC0805  [C0805]
C922  10n  C-EUC0805  [C0805]
C931  10n  C-EUC0805  [C0805]
C951  10n  C-EUC0805  [C0805]
CON4  AVR-ISP-6SMD  [2X3SMD]
CON5  AVR-JTAG-10SMD  [2X5SMD]
CON6  HEADER-2X3SMD  [2X03SMD]
D82  CRS08  ZENER-DIODESOT23  [SOT23]
D202  BZX84-C2V7  BZX84CSMD  [TO236]
D221  BZX84-C3V0  BZX84CSMD  [TO236]
IC3  74HCT221D  [SO16]
IC4  CFPT-141  [CFPT-141]
JP1  SJW  [SJW]
JP2  SJW  [SJW]
JP3  SJW  [SJW]
L31  10uH  L-EUL1812  [L1812]
R21  2.7k  R-EU_R0805  [R0805]
R22  2.7k  R-EU_R0805  [R0805]
R23  2.7k  R-EU_R0805  [R0805]
R25  2.7k  R-EU_R0805  [R0805]
R41  12k  R-EU_R0805  [R0805]
R51  1k  R-EU_R0805  [R0805]
R52  1k  R-EU_R0805  [R0805]
R71  1.5k  R-EU_R0805  [R0805]
R81  1k  R-EU_R0805  [R0805]
R221  56  R-EU_R0805  [R0805]
RPOLY2  1206L012WR_0.1A  R-EU_M1206  [M1206]
SJ21  SJ  [SJ]
SJ22  SJ  [SJ]

### Nets
+3V0 [PWR_LOW]: C221.1 D221.C IC4.4(VCC_3V0) R221.2
+3V3 [PWR_LOW]: C921.1 C922.1 CON6.5 D82.1(A) D202.C R221.1 RPOLY2.2 SJ22.2
ADC_PHASE: R52.2
ADC_PHASE_PULLHOLD: C51.1 R51.2
AREF: C32.1
AVCC: C31.2 L31.1
CPLD_GPS_NMEA_TX: R25.2
GND [PWR_HI]: C31.1 C32.2 C51.2 C81.- C221.2 C911.2 C921.2 C922.2 C931.2 C951.2 CON4.6 CON5.2 CON5.10 CON6.1 CON6.6 D221.A IC3.8(P:GND) IC4.2(GND) JP3.1 R52.1 SJ21.1 ; also sheet 1,8,10,14
GND_SJ1: SJ21.2
GPS_ANT_PWR [PWR_MED]: RPOLY2.1
GPS_NMEA_TX: R25.1 ; also sheet 8
INT1: JP3.2
ISP_MISO: CON4.1 R22.1
ISP_MOSI: CON4.4
ISP_SCK: CON4.3 R23.2
ISP_VTARGET: CON4.2 JP2.1
JTAG_SRST: CON4.5 CON5.6 JP1.2 R21.2
JTAG_TCK: CON5.1
JTAG_TDI: CON5.9
JTAG_TDO: CON5.3
JTAG_TMS: CON5.5
JTAG_VREF: CON5.4 R81.1
MISO: R22.2
N$1: CON6.2
N$3: CON6.4
N$44: C72.2
N$45: C72.1
N$47: C71.2 R71.1
N$48: C71.1
N_ADC_PULL: D202.A IC4.1(VC)
PHASE_ERROR: R51.1
PWR_BACKUP_GPS [PWR_LOW]: C81.+ D82.3(C) ; also sheet 1,8
RESET: JP1.1 R41.2
SS: R21.1
TOSC1: IC4.3(OUT)
VCC [PWR_MED]: C911.1 C931.1 C951.1 CON5.7 CON6.3 IC3.16(P:VCC) JP2.2 L31.2 R41.1 R71.2 R81.2
VCC_3V3_SJ2: SJ22.1
Unconnected: CON5.8 IC3.1(A:A) IC3.2(A:B) IC3.3(A:R) IC3.4(A:!Q) IC3.5(B:Q) IC3.6(B:C) IC3.7(B:R/C) IC3.9(B:A) IC3.10(B:B) IC3.11(B:R) IC3.12(B:!Q) IC3.13(A:Q) IC3.14(A:C) IC3.15(A:R/C) R23.1

### Notes on the sheet
- DF4IAH  10 MHz Reference Oscillator
  V 2.0
- I2C | IC-Supplies
- GPS - PINs:
  
   1 GND
   2 V_BAT, Memory Supply, Goldcap
   3 VCC 5V
   4 V_ANT 5V, fused
   5 GPS NMEA RX
   6 GPS NMEA TX
   7 PPS (1 Hz)
   8 Ref. 10 kHz
   9 GND
  10 GND
- I2C - PINs:
  
   1 GND
   2 SCL
   3 VCC 5V
   4 SDA
   5 3.3V
   6 GND
- GPS-Module
- ADC-Pull | debugWIRE
- Bootloader | VTarget
- AVR - PINs:
  
  - PB0  20 MHz Clock Out             (ICP)
  - PB1  USB Disconnect               (DigOut)
  - PB2  ISP SS                       (SS)
  - PB3  ISP MOSI                     (MOSI)
  - PB4  ISP MISO                     (MISO)
  - PB5  ISP SCK                      (SCK)
  - PB6  Crystal 20 MHz In            (XTAL1)
  - PB7  Crystal 20 MHz Out           (XTAL2)
  - PC0  ADC0 Pull Voltage            (ADC0)
  - PC1  ADC1  Phase Error            (ADC1)
  - PC2  USB D+                       (DigIn/DigOut)
  - PC3  USB D-                       (DigIn/DigOut)
  - PC4  reserved                     (I2C SDA)
  - PC5  reserved                     (I2C SCL)
  - PD0  GPS Data In                  (RXD)
  - PD1  GPS Data Out                 (TXD)
  - PD2  USB D-                       (INT0)
  - PD3  Bootloader JP3               (DigIn)
  - PD4  GPS PPS                      (T0)
  - PD5  PWM Pull for Ref.-Osc.       (OC0B)
  - PD6  +  Comparator for RefClk In  (AIN0)
  - PD7  -  Comparator for RefClk In  (AIN1)
- NC
- ADC-Phase
- Sync | Gate
- SPI - PINs:
  
   1 MISO
   2 V-Target
   3 SCK
   4 MOSI
   5 RST
   6 GND
- t=33ns | t=362ns
- 2.5 MHz out
- Sync in
- 20 MHz in | Gate in | Pull & Hold
- 10 MHz out | Phase out | Phase-Error
- RESET in
- JTAG_TDI
- Gate Trig out
- JTAG_TCK
- PPS
- 10 kHz
- JTAG_TMS
- JTAG_TDO
- CPLD_SER_GPS

## Library data of the parts
C3 C81 = rcl:CPOL-EU: POLARIZED CAPACITOR, European symbol
C4 C31 C32 C51 C71 C72 C221 C911 C921 C922 C931 C951 = rcl:C-EU: CAPACITOR, European symbol
C111 = df4iah:C-EU: CAPACITOR, European symbol
CON1 = df4iah:MOLEX_BNC-JACK-50R_SD-73100-0105: MOLEX BNC-Jack 50 Ohm SD-73100-0102; MF: MOLEX; MPN: SD-73100-0105; OC_FARNELL: 1909203; OC_NEWARK: -
CON2 = df4iah:TYCO-AMP_USB: TYCO-AMP USB-Connectors From Catalog 7-1773422-0 Issued 03-06; MF: TYCO-AMP; MPN: 1734346; OC_FARNELL: 1321918
CON3 CON7-CON10 = df4iah:MCX-J-P-X-RA-SM1: FEMALE SMA CONNECTOR Radiall
CON4 = atmel-1:AVR-ISP-6: AVR ISP-6 Serial Programming Header
CON5 = df4iah:AVR-JTAG-10: AVR JTAG Debug/Programming Header
CON6 = df4iah:HEADER-2X3: Header 2X3 2.54mm ISP, ...
D3 D4 D202 D221 = diode:BZX84CSMD: Z DIODE
D82 = diode:ZENER-DIODE: Z-Diode
IC3 = 74xx-eu:74*221: Dual Monostable MULTIVIBRATOR, schmitt trigger inputs
IC4 = df4iah:CFPT-141: TCXO, 3.0V; MF: IQD-FREQUENCY-PRODUCTS; MPN: LFTVXO022175; OC_FARNELL: 1100745; OC_NEWARK: -
IC11 = df4iah:712-RXM-GNSS-TM-B: Linx TM-Series 712-RXM-GNSS-TM-B Linx Technologies TM Series GNSS Receiver Module data entry: 2015-01-11 by DF4IAH.
JP1-JP3 SJ21 SJ22 = jumper:SJ: SMD solder JUMPER
L31 = rcl:L-EU: INDUCTOR, European symbol
LFP111 = df4iah:L-EU: INDUCTOR, European symbol
R5-R8 R10 R21-R23 R25 R41 R51 R52 R71 R81 R221 RPOLY2 RPOLY3 = rcl:R-EU_: RESISTOR, European symbol

## Net classes
1 PWR_LOW: width 0.508 mm
2 PWR_MED: width 0.635 mm
3 PWR_HI: width 0.762 mm
4 PAIR_50R: width 2.819 mm, clearance 5.08 mm
5 PAIR_100R: width 1.143 mm, clearance 3.81 mm
6 CLK: clearance 1.27 mm